# EAGLE design FPGA_Board (EAGLE 6.1)
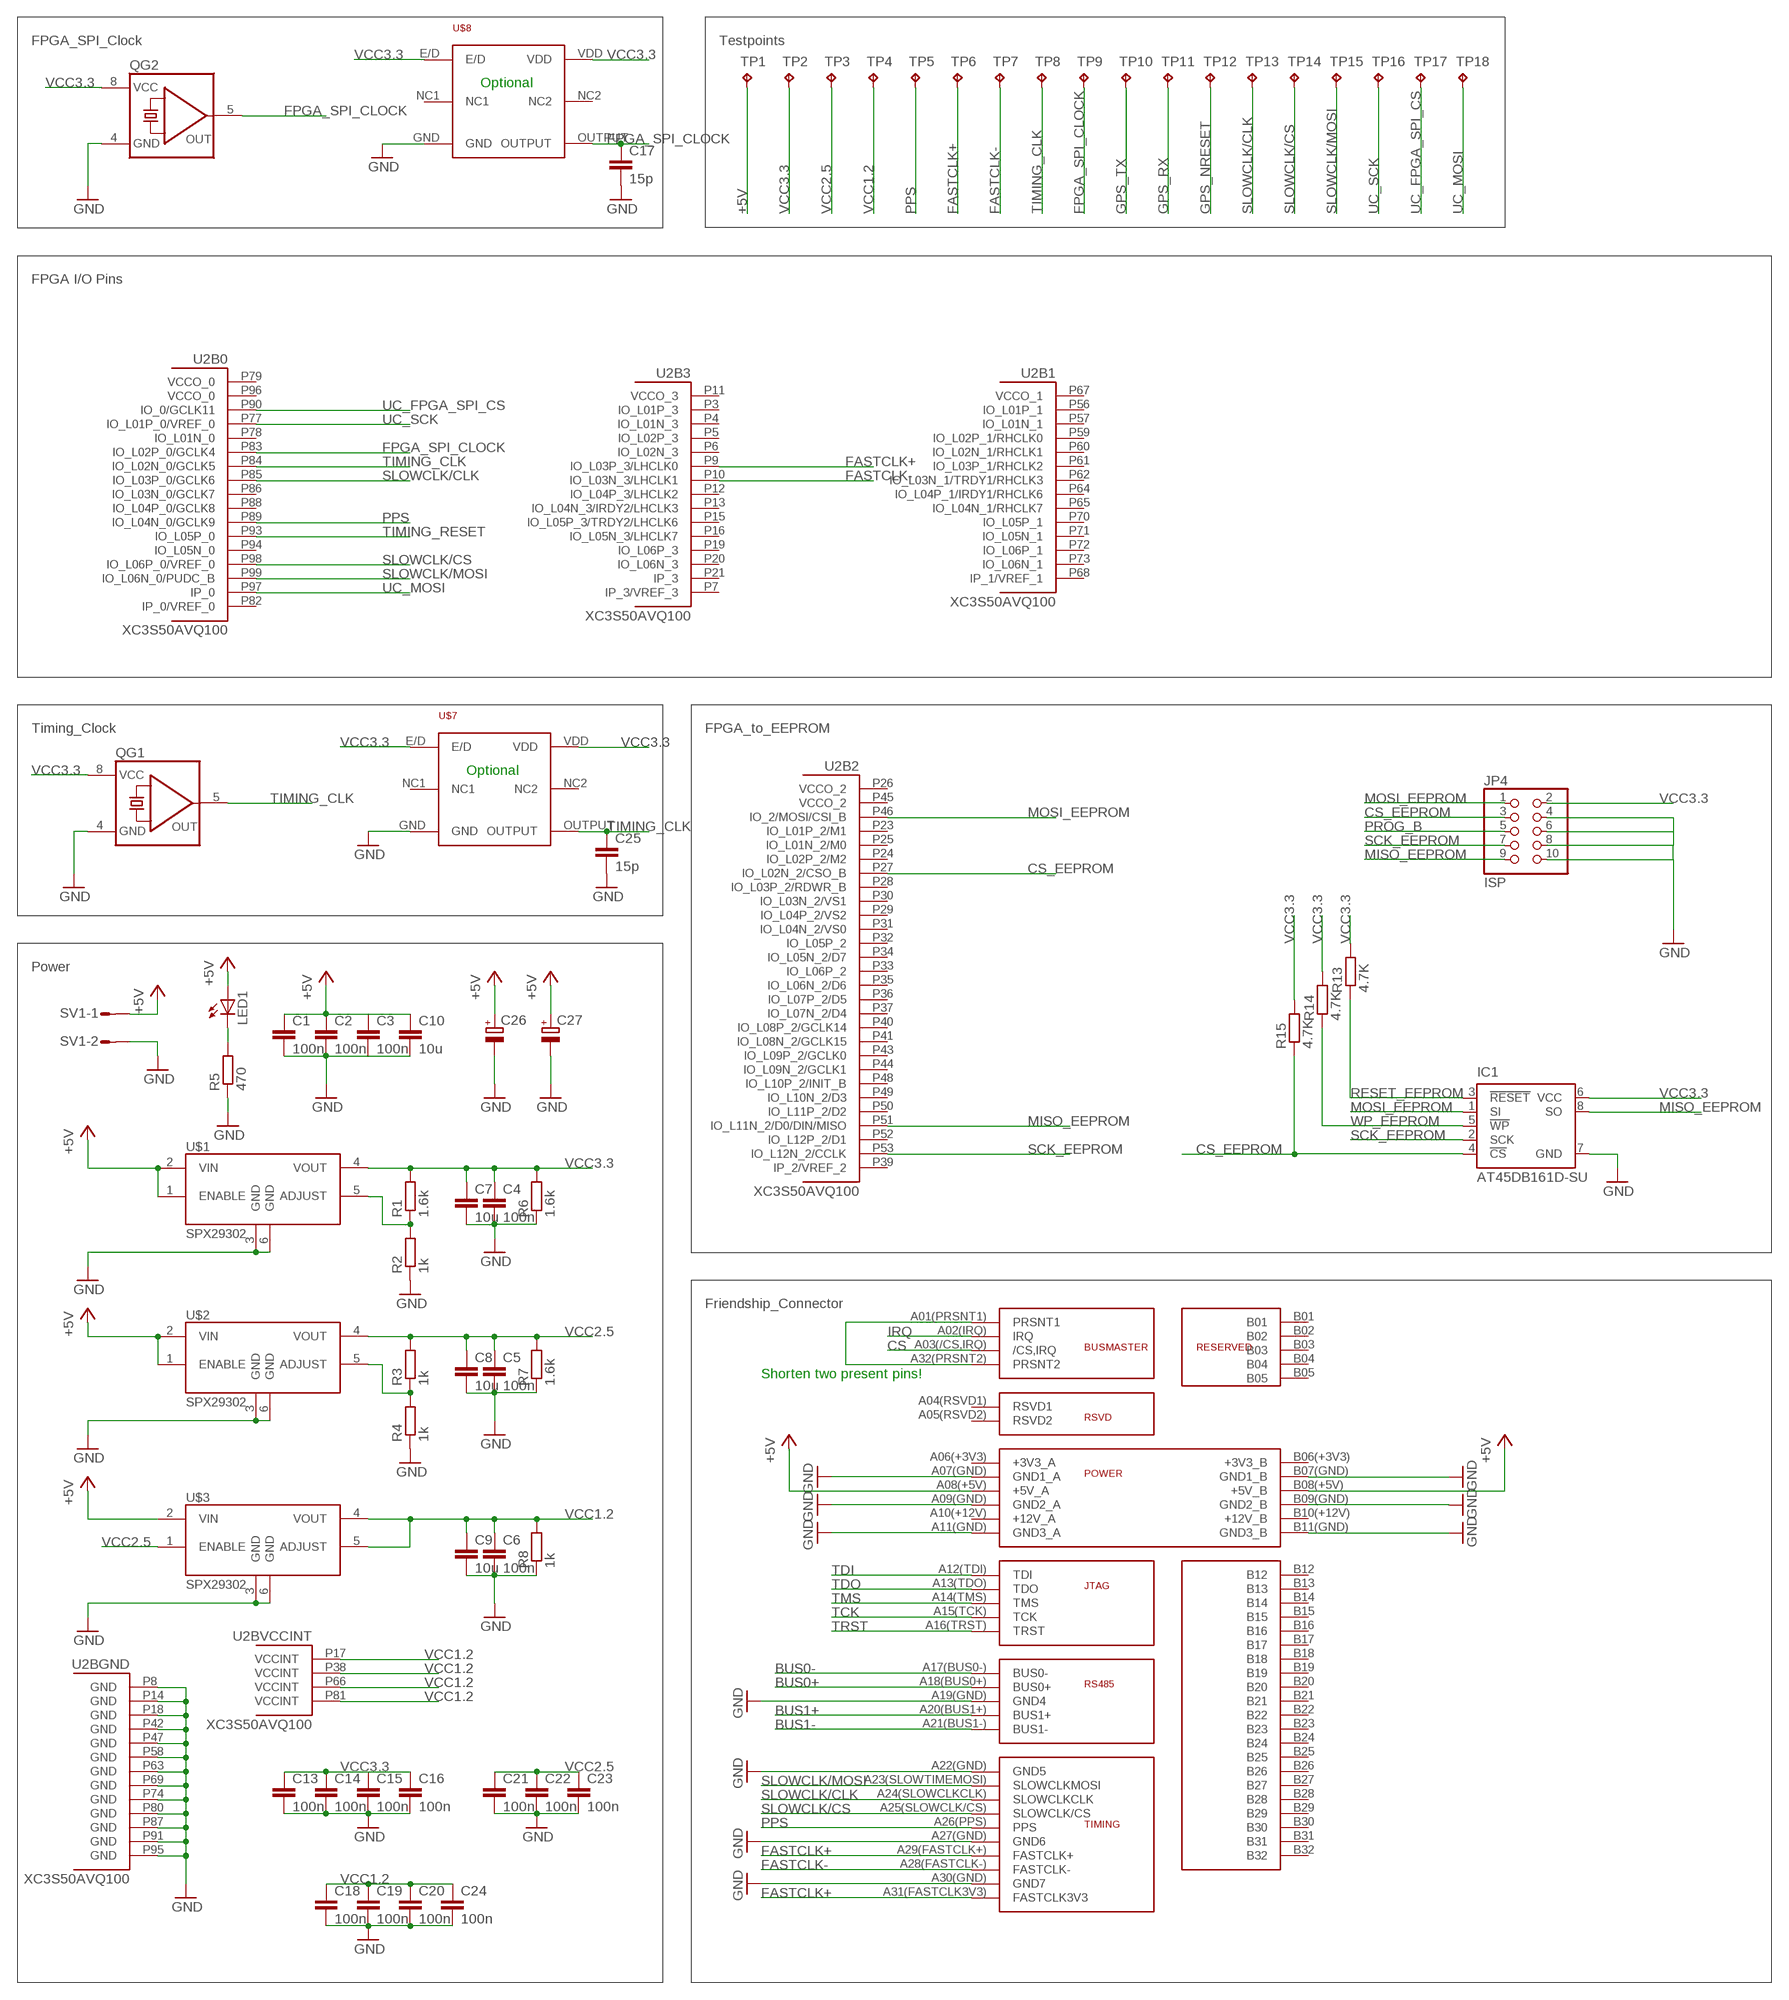
[diagram p0: schematic, sheet 1, part 1 of 2]
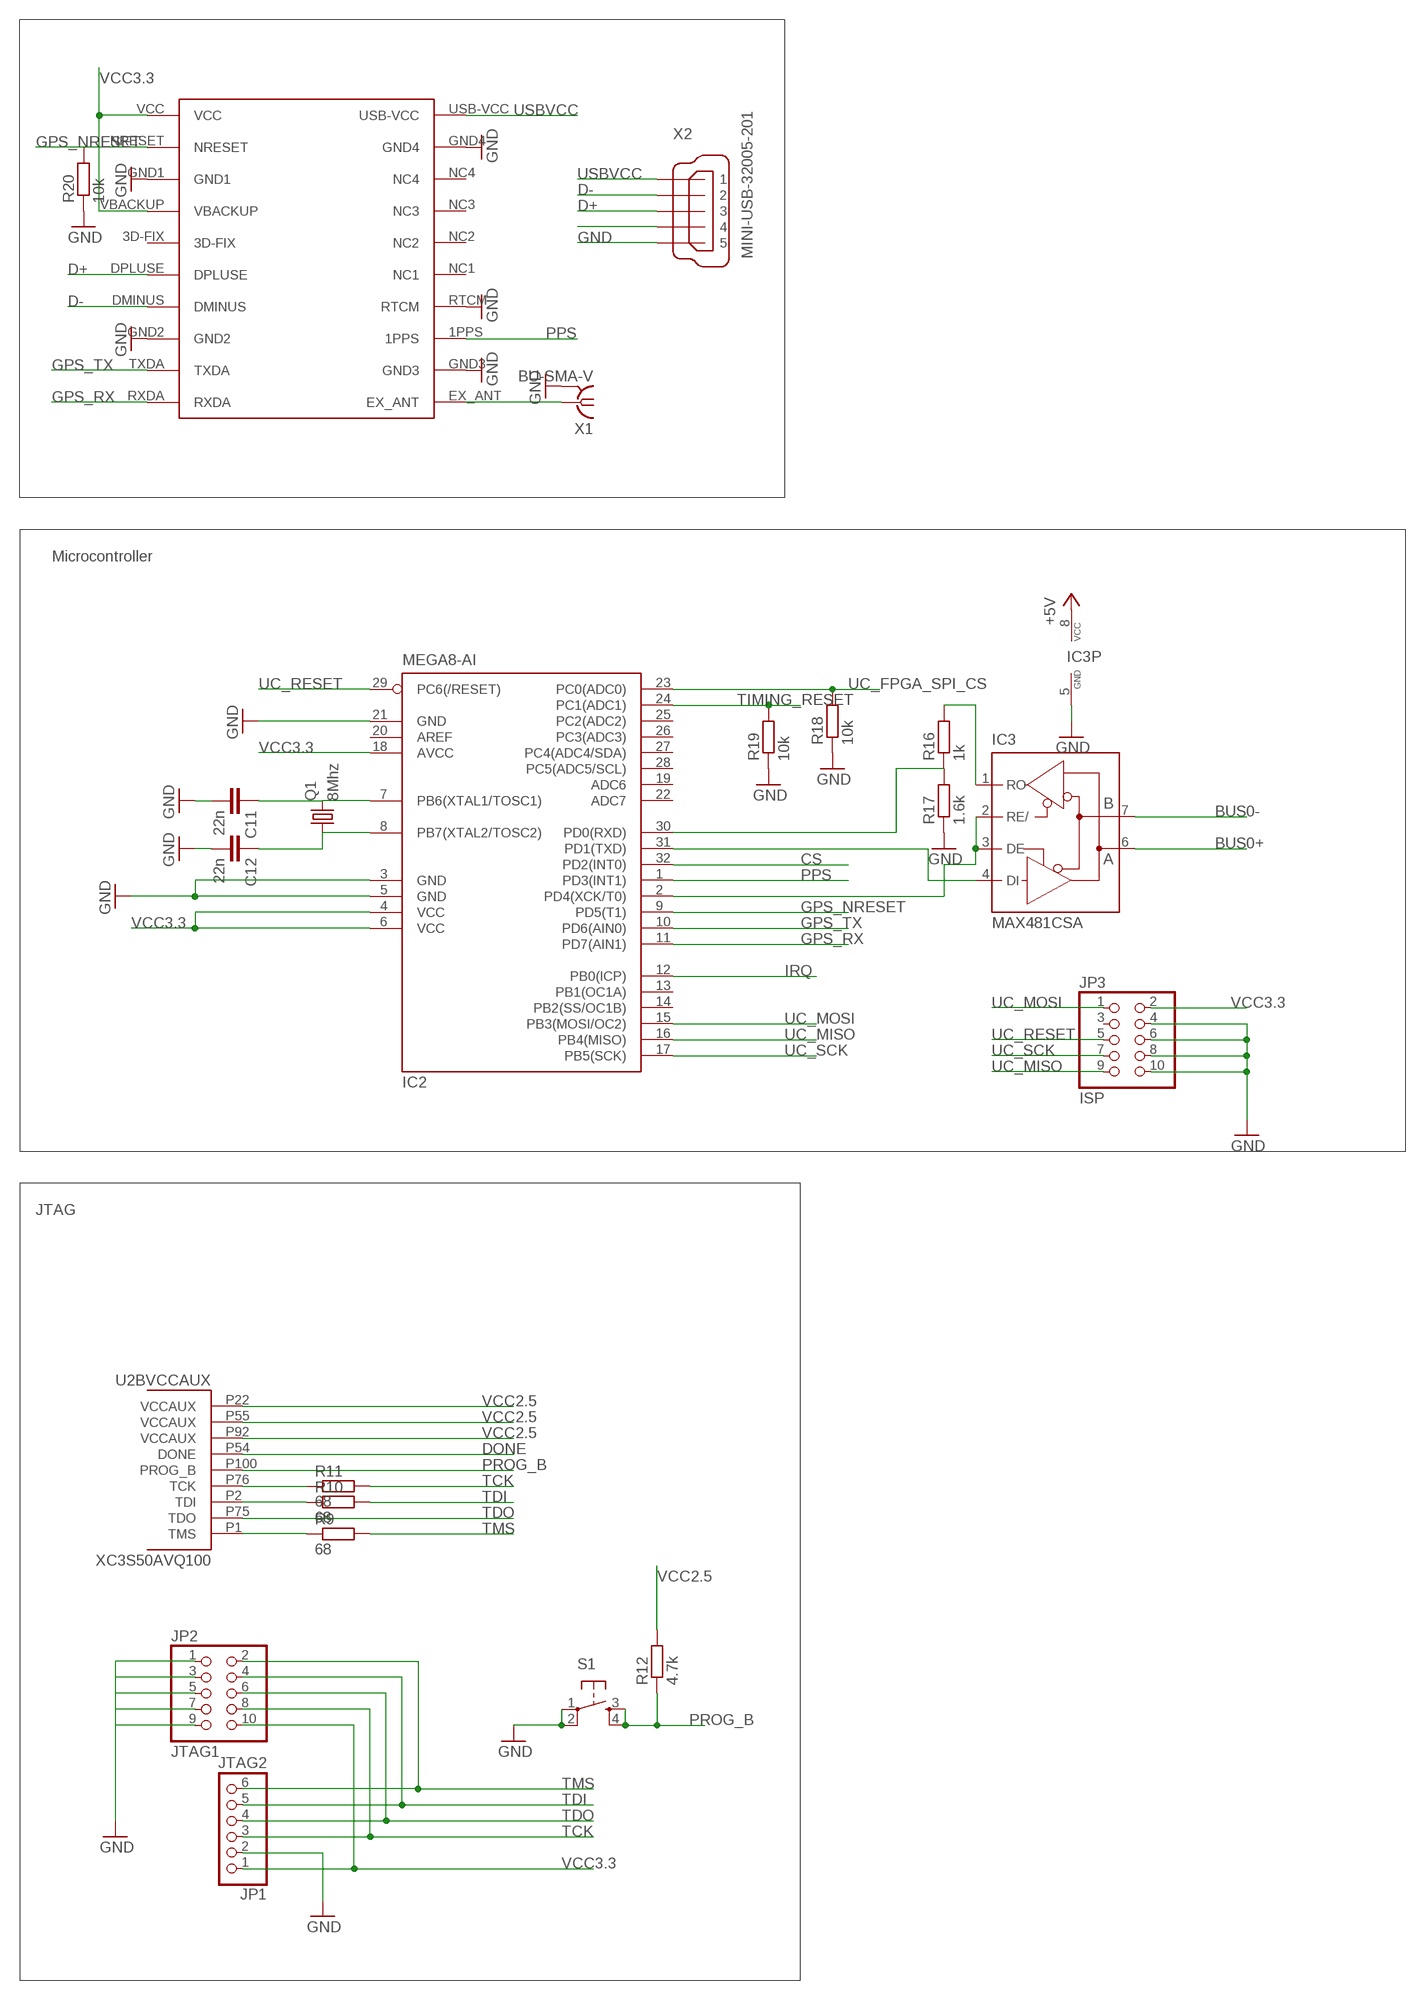
[diagram p1: schematic, sheet 1, part 2 of 2]

## Parts
C1  100n  C-EUC0603  [C0603]
C2  100n  C-EUC0603  [C0603]
C3  100n  C-EUC0603  [C0603]
C4  100n  C-EUC0603  [C0603]
C5  100n  C-EUC0603  [C0603]
C6  100n  C-EUC0603  [C0603]
C7  10u  C-EUC0603  [C0603]
C8  10u  C-EUC0603  [C0603]
C9  10u  C-EUC0603  [C0603]
C10  10u  C-EUC0603  [C0603]
C11  22n  C-EUC0603  [C0603]
C12  22n  C-EUC0603  [C0603]
C13  100n  C-EUC0603  [C0603]
C14  100n  C-EUC0603  [C0603]
C15  100n  C-EUC0603  [C0603]
C16  100n  C-EUC0603  [C0603]
C17  15p  C-EUC0603  [C0603]
C18  100n  C-EUC0603  [C0603]
C19  100n  C-EUC0603  [C0603]
C20  100n  C-EUC0603  [C0603]
C21  100n  C-EUC0603  [C0603]
C22  100n  C-EUC0603  [C0603]
C23  100n  C-EUC0603  [C0603]
C24  100n  C-EUC0603  [C0603]
C25  15p  C-EUC0603  [C0603]
C26  CPOL-EUE5-8.5  [E5-8,5]
C27  CPOL-EUE5-8.5  [E5-8,5]
IC1  AT45DB161D-SU  [8S2]
IC2  MEGA8-AI  [TQFP32-08]
IC3  MAX481CSA  [SO08]
JP1  JTAG2  PINHD-1X6  [1X06]
JP2  JTAG1  PINHD-2X5  [2X05]
JP3  ISP  PINHD-2X5  [2X05]
JP4  ISP  PINHD-2X5  [2X05]
LED1  LEDCHIPLED_0805  [CHIPLED_0805]
Q1  8Mhz  CRYSTALSM49  [SM49]
QG1  QG5460  [DIL08S]
QG2  QG5460  [DIL08S]
R1  1.6k  R-EU_R0603  [R0603]
R2  1k  R-EU_R0603  [R0603]
R3  1k  R-EU_R0603  [R0603]
R4  1k  R-EU_R0603  [R0603]
R5  470  R-EU_R0603  [R0603]
R6  1.6k  R-EU_R0603  [R0603]
R7  1.6k  R-EU_R0603  [R0603]
R8  1k  R-EU_R0603  [R0603]
R9  68  R-EU_R0603  [R0603]
R10  68  R-EU_R0603  [R0603]
R11  68  R-EU_R0603  [R0603]
R12  4.7k  R-EU_R0603  [R0603]
R13  4.7K  R-EU_R0603  [R0603]
R14  4.7K  R-EU_R0603  [R0603]
R15  4.7K  R-EU_R0603  [R0603]
R16  1k  R-EU_R0603  [R0603]
R17  1.6k  R-EU_R0603  [R0603]
R18  10k  R-EU_R0603  [R0603]
R19  10k  R-EU_R0603  [R0603]
R20  10k  R-EU_R0603  [R0603]
S1  TAC_SWITCHPTH  [TACTILE-PTH]
SV1  L02P  [L02P]
TP1  TPB2,54  [B2,54]
TP2  TPB2,54  [B2,54]
TP3  TPB2,54  [B2,54]
TP4  TPB2,54  [B2,54]
TP5  TPB2,54  [B2,54]
TP6  TPB2,54  [B2,54]
TP7  TPB2,54  [B2,54]
TP8  TPB2,54  [B2,54]
TP9  TPB2,54  [B2,54]
TP10  TPB2,54  [B2,54]
TP11  TPB2,54  [B2,54]
TP12  TPB2,54  [B2,54]
TP13  TPB2,54  [B2,54]
TP14  TPB2,54  [B2,54]
TP15  TPB2,54  [B2,54]
TP16  TPB2,54  [B2,54]
TP17  TPB2,54  [B2,54]
TP18  TPB2,54  [B2,54]
U2  XC3S50AVQ100  [VQ100]
U$1  SPX29302  [Q5-DD_SPX29300]
U$2  SPX29302  [Q5-DD_SPX29300]
U$3  SPX29302  [Q5-DD_SPX29300]
U$4  FRIENDSHIPCONNECTOR  [FRIENDSHIP_EDGE_CONNECTOR]
U$5  HGG_LOGO  [HGG_LOGO]
U$6  GPS  [GPS]
U$7  OSCILLATOR  [OSCILLATOR]
U$8  OSCILLATOR  [OSCILLATOR]
X1  BU-SMA-V  [BU-SMA-V]
X2  MINI-USB-32005-201  [32005-201]

## Nets
+5V: C1.1 C2.1 C3.1 C10.1 C26.+ C27.+ IC3.8(VCC) LED1.A SV1.1 TP1.TP U$1.1(ENABLE) U$1.2(VIN) U$2.1(ENABLE) U$2.2(VIN) U$3.2(VIN) U$4.A08(+5V)(+5V_A) U$4.B08(+5V)(+5V_B)
BUS0+: IC3.6(A) U$4.A18(BUS0+)(BUS0+)
BUS0-: IC3.7(B) U$4.A17(BUS0-)(BUS0-)
BUS1+: U$4.A20(BUS1+)(BUS1+)
BUS1-: U$4.A21(BUS1-)(BUS1-)
CS: IC2.32(PD2(INT0)) U$4.A03(/CS,IRQ)(/CS,IRQ)
CS_EEPROM: IC1.4(!CS) JP4.3 R15.1 U2.P27(B2:IO_L02N_2/CSO_B)
D+: U$6.DPLUSE X2.3
D-: U$6.DMINUS X2.2
DI: IC2.31(PD1(TXD)) IC3.4(DI)
DONE: U2.P54(BVCCAUX:DONE)
FASTCLK+: TP6.TP U2.P9(B3:IO_L03P_3/LHCLK0) U$4.A29(FASTCLK+)(FASTCLK+) U$4.A31(FASTCLK3V3)(FASTCLK3V3)
FASTCLK-: TP7.TP U2.P10(B3:IO_L03N_3/LHCLK1) U$4.A28(FASTCLK-)(FASTCLK-)
FPGA_SPI_CLOCK: C17.1 QG2.5(OUT) TP9.TP U2.P83(B0:IO_L02P_0/GCLK4) U$8.OUTPUT
GND: C1.2 C2.2 C3.2 C4.2 C5.2 C6.2 C7.2 C8.2 C9.2 C10.2 C11.2 C12.2 C13.2 C14.2 C15.2 C16.2 C17.2 C18.2 C19.2 C20.2 C21.2 C22.2 C23.2 C24.2 C25.2 C26.- C27.- IC1.7(GND) IC2.3(GND) IC2.5(GND) IC2.21(GND) IC3.5(GND) JP1.2 JP2.1 JP2.3 JP2.5 JP2.7 JP2.9 JP3.4 JP3.6 JP3.8 JP3.10 JP4.4 JP4.6 JP4.8 JP4.10 QG1.4(GND) QG2.4(GND) R2.1 R4.1 R5.1 R6.1 R7.1 R8.1 R17.1 R18.1 R19.1 R20.1 S1.1 S1.2 SV1.2 U2.P8(BGND:GND) U2.P14(BGND:GND) U2.P18(BGND:GND) U2.P42(BGND:GND) U2.P47(BGND:GND) U2.P58(BGND:GND) U2.P63(BGND:GND) U2.P69(BGND:GND) U2.P74(BGND:GND) U2.P80(BGND:GND) U2.P87(BGND:GND) U2.P91(BGND:GND) U2.P95(BGND:GND) U$1.3(GND) U$1.6(GND) U$2.3(GND) U$2.6(GND) U$3.3(GND) U$3.6(GND) U$4.A07(GND)(GND1_A) U$4.A09(GND)(GND2_A) U$4.A11(GND)(GND3_A) U$4.A19(GND)(GND4) U$4.A22(GND)(GND5) U$4.A27(GND)(GND6) U$4.A30(GND)(GND7) U$4.B07(GND)(GND1_B) U$4.B09(GND)(GND2_B) U$4.B11(GND)(GND3_B) U$6.GND1 U$6.GND2 U$6.GND3 U$6.GND4 U$6.RTCM U$7.GND U$8.GND X1.2(GND) X2.5
GPS_NRESET: IC2.9(PD5(T1)) R20.2 TP12.TP U$6.NRESET
GPS_RX: IC2.11(PD7(AIN1)) TP11.TP U$6.RXDA
GPS_TX: IC2.10(PD6(AIN0)) TP10.TP U$6.TXDA
IRQ: IC2.12(PB0(ICP)) U$4.A02(IRQ)(IRQ)
MISO_EEPROM: IC1.8(SO) JP4.9 U2.P51(B2:IO_L11N_2/D0/DIN/MISO)
MOSI_EEPROM: IC1.1(SI) JP4.1 U2.P46(B2:IO_2/MOSI/CSI_B)
N$1: R11.1 U2.P76(BVCCAUX:TCK)
N$2: R10.1 U2.P2(BVCCAUX:TDI)
N$3: LED1.C R5.2
N$4: R9.1 U2.P1(BVCCAUX:TMS)
N$5: IC2.2(PD4(XCK/T0)) IC3.2(RE/) IC3.3(DE)
N$6: IC2.30(PD0(RXD)) R16.1 R17.2
N$7: R1.1 R2.2 U$1.5(ADJUST)
N$8: R3.1 R4.2 U$2.5(ADJUST)
N$9: IC3.1(RO) R16.2
N$11: C11.1 IC2.7(PB6(XTAL1/TOSC1)) Q1.2
N$12: C12.1 IC2.8(PB7(XTAL2/TOSC2)) Q1.1
N$13: U$4.A01(PRSNT1)(PRSNT1) U$4.A32(PRSNT2)(PRSNT2)
N$14: U$6.EX_ANT X1.1
N$15: X2.4
PPS: IC2.1(PD3(INT1)) TP5.TP U2.P89(B0:IO_L04N_0/GCLK9) U$4.A26(PPS)(PPS) U$6.1PPS
PROG_B: JP4.5 R12.1 S1.3 S1.4 U2.P100(BVCCAUX:PROG_B)
RESET_EEPROM: IC1.3(!RESET) R13.1
SCK_EEPROM: IC1.2(SCK) JP4.7 U2.P53(B2:IO_L12N_2/CCLK)
SLOWCLK/CLK: TP13.TP U2.P85(B0:IO_L03P_0/GCLK6) U$4.A24(SLOWCLKCLK)(SLOWCLKCLK)
SLOWCLK/CS: TP14.TP U2.P98(B0:IO_L06P_0/VREF_0) U$4.A25(SLOWCLK/CS)(SLOWCLK/CS)
SLOWCLK/MOSI: TP15.TP U2.P99(B0:IO_L06N_0/PUDC_B) U$4.A23(SLOWTIMEMOSI)(SLOWCLKMOSI)
TCK: JP1.3 JP2.8 R11.2 U$4.A15(TCK)(TCK)
TDI: JP1.5 JP2.4 R10.2 U$4.A12(TDI)(TDI)
TDO: JP1.4 JP2.6 U2.P75(BVCCAUX:TDO) U$4.A13(TDO)(TDO)
TIMING_CLK: C25.1 QG1.5(OUT) TP8.TP U2.P84(B0:IO_L02N_0/GCLK5) U$7.OUTPUT
TIMING_RESET: IC2.24(PC1(ADC1)) R19.2 U2.P93(B0:IO_L05P_0)
TMS: JP1.6 JP2.2 R9.2 U$4.A14(TMS)(TMS)
TRST: U$4.A16(TRST)(TRST)
UC_FPGA_SPI_CS: IC2.23(PC0(ADC0)) R18.2 TP17.TP U2.P90(B0:IO_0/GCLK11)
UC_MISO: IC2.16(PB4(MISO)) JP3.9
UC_MOSI: IC2.15(PB3(MOSI/OC2)) JP3.1 TP18.TP U2.P97(B0:IP_0)
UC_RESET: IC2.29(PC6(/RESET)) JP3.5
UC_SCK: IC2.17(PB5(SCK)) JP3.7 TP16.TP U2.P77(B0:IO_L01P_0/VREF_0)
USBVCC: U$6.USB-VCC X2.1
VCC1.2: C6.1 C9.1 C18.1 C19.1 C20.1 C24.1 R8.2 TP4.TP U2.P17(BVCCINT:VCCINT) U2.P38(BVCCINT:VCCINT) U2.P66(BVCCINT:VCCINT) U2.P81(BVCCINT:VCCINT) U$3.4(VOUT) U$3.5(ADJUST)
VCC2.5: C5.1 C8.1 C21.1 C22.1 C23.1 R3.2 R7.2 R12.2 TP3.TP U2.P22(BVCCAUX:VCCAUX) U2.P55(BVCCAUX:VCCAUX) U2.P92(BVCCAUX:VCCAUX) U$2.4(VOUT) U$3.1(ENABLE)
VCC3.3: C4.1 C7.1 C13.1 C14.1 C15.1 C16.1 IC1.6(VCC) IC2.4(VCC) IC2.6(VCC) IC2.18(AVCC) JP1.1 JP2.10 JP3.2 JP4.2 QG1.8(VCC) QG2.8(VCC) R1.2 R6.2 R13.2 R14.2 R15.2 TP2.TP U$1.4(VOUT) U$6.VBACKUP U$6.VCC U$7.E/D U$7.VDD U$8.E/D U$8.VDD
WP_EEPROM: IC1.5(!WP) R14.1
Unconnected: IC2.13(PB1(OC1A)) IC2.14(PB2(SS/OC1B)) IC2.19(ADC6) IC2.20(AREF) IC2.22(ADC7) IC2.25(PC2(ADC2)) IC2.26(PC3(ADC3)) IC2.27(PC4(ADC4/SDA)) IC2.28(PC5(ADC5/SCL)) JP3.3 U2.P3(B3:IO_L01P_3) U2.P4(B3:IO_L01N_3) U2.P5(B3:IO_L02P_3) U2.P6(B3:IO_L02N_3) U2.P7(B3:IP_3/VREF_3) U2.P11(B3:VCCO_3) U2.P12(B3:IO_L04P_3/LHCLK2) U2.P13(B3:IO_L04N_3/IRDY2/LHCLK3) U2.P15(B3:IO_L05P_3/TRDY2/LHCLK6) U2.P16(B3:IO_L05N_3/LHCLK7) U2.P19(B3:IO_L06P_3) U2.P20(B3:IO_L06N_3) U2.P21(B3:IP_3) U2.P23(B2:IO_L01P_2/M1) U2.P24(B2:IO_L02P_2/M2) U2.P25(B2:IO_L01N_2/M0) U2.P26(B2:VCCO_2) U2.P28(B2:IO_L03P_2/RDWR_B) U2.P29(B2:IO_L04P_2/VS2) U2.P30(B2:IO_L03N_2/VS1) U2.P31(B2:IO_L04N_2/VS0) U2.P32(B2:IO_L05P_2) U2.P33(B2:IO_L06P_2) U2.P34(B2:IO_L05N_2/D7) U2.P35(B2:IO_L06N_2/D6) U2.P36(B2:IO_L07P_2/D5) U2.P37(B2:IO_L07N_2/D4) U2.P39(B2:IP_2/VREF_2) U2.P40(B2:IO_L08P_2/GCLK14) U2.P41(B2:IO_L08N_2/GCLK15) U2.P43(B2:IO_L09P_2/GCLK0) U2.P44(B2:IO_L09N_2/GCLK1) U2.P45(B2:VCCO_2) U2.P48(B2:IO_L10P_2/INIT_B) U2.P49(B2:IO_L10N_2/D3) U2.P50(B2:IO_L11P_2/D2) U2.P52(B2:IO_L12P_2/D1) U2.P56(B1:IO_L01P_1) U2.P57(B1:IO_L01N_1) U2.P59(B1:IO_L02P_1/RHCLK0) U2.P60(B1:IO_L02N_1/RHCLK1) U2.P61(B1:IO_L03P_1/RHCLK2) U2.P62(B1:IO_L03N_1/TRDY1/RHCLK3) U2.P64(B1:IO_L04P_1/IRDY1/RHCLK6) U2.P65(B1:IO_L04N_1/RHCLK7) U2.P67(B1:VCCO_1) U2.P68(B1:IP_1/VREF_1) U2.P70(B1:IO_L05P_1) U2.P71(B1:IO_L05N_1) U2.P72(B1:IO_L06P_1) U2.P73(B1:IO_L06N_1) U2.P78(B0:IO_L01N_0) U2.P79(B0:VCCO_0) U2.P82(B0:IP_0/VREF_0) U2.P86(B0:IO_L03N_0/GCLK7) U2.P88(B0:IO_L04P_0/GCLK8) U2.P94(B0:IO_L05N_0) U2.P96(B0:VCCO_0) U$4.A04(RSVD1)(RSVD1) U$4.A05(RSVD2)(RSVD2) U$4.A06(+3V3)(+3V3_A) U$4.A10(+12V)(+12V_A) U$4.B01 U$4.B02 U$4.B03 U$4.B04 U$4.B05 U$4.B06(+3V3)(+3V3_B) U$4.B10(+12V)(+12V_B) U$4.B12 U$4.B13 U$4.B14 U$4.B15 U$4.B16 U$4.B17 U$4.B18 U$4.B19 U$4.B20 U$4.B21 U$4.B22 U$4.B23 U$4.B24 U$4.B25 U$4.B26 U$4.B27 U$4.B28 U$4.B29 U$4.B30 U$4.B31 U$4.B32 U$6.3D-FIX U$6.NC1 U$6.NC2 U$6.NC3 U$6.NC4 U$7.NC1 U$7.NC2 U$8.NC1 U$8.NC2

## Notes on the sheet
- FPGA_SPI_Clock | Testpoints
- Optional
- FPGA I/O Pins
- Timing_Clock | FPGA_to_EEPROM | Microcontroller
- Optional
- Power
- Friendship_Connector | JTAG
- Shorten two present pins!

## Power pins joined to a net without a drawn wire
GND: X1.3(GND) X1.4(GND) X1.5(GND)

## Library data of the parts
C1-C25 = resistor:C-EU: CAPACITOR, European symbol
C26 C27 = resistor:CPOL-EU: POLARIZED CAPACITOR, European symbol
IC1 = atmel:AT45DB161D: 16-megabit 2.5V or 2.7V DataFlash Source: http://www.atmel.com/dyn/resources/prod_documents/doc3500.pdf; MF: ATMEL; MPN: AT45DB161D-SU; OC_FARNELL: 1455040
IC2 = atmel:MEGA8: MICROCONTROLLER 8 Kbytes FLASH, 1 kbytes SRAM, 512 bytes EEPROM, USART, 6-channel 10 bit ADC, 2-channel 8 bit ADC Pin compatible with Atmega48, ATMega88, ATMega168 Source: avr.lbr; MPN: ATMEGA8-16AU; OC_FARNELL: 9171371; OC_NEWARK: 73M8863
IC3 = maxim:MAX481CSA: RS485 TRANSEIVER; MF: MAXIM; MPN: MAX481CSA; OC_FARNELL: unknown; OC_NEWARK: 90C3817
JP1 = pinhead:PINHD-1X6: PIN HEADER
JP2-JP4 = pinhead:PINHD-2X5: PIN HEADER
LED1 = led:LED: LED OSRAM: - CHIPLED LG R971, LG N971, LY N971, LG Q971, LY Q971, LO R971, LY R971 LH N974, LH R974 LS Q976, LO Q976, LY Q976 LO Q996 - Hyper CHIPLED LW Q18S LB Q993, LB Q99A, LB R99A - SideLED LS A670, LO A670, LY A670, LG A670, LP A670 LB A673, LV A673, LT A673, LW A673 LH A674 LY A675 LS A676, LA A676, LO A676, LY A676, LW A676 LS A679, LY A679, LG A679 - Hyper Micro SIDELED® LS Y876, LA Y876, LO Y876, LY Y876 LT Y87S - SmartLED LW L88C, LW L88S LB L89C, LB L89S, LG L890 LS L89K, LO L89K, LY L89K LS L896, LA L896, LO L896, LY L896 - TOPLED LS T670, LO T670, LY T670, LG T670, LP T670 LSG T670, LSP T670, LSY T670, LOP T670, LYG T670 LG T671, LOG T671, LSG T671 LB T673, LV T673, LT T673, LW T673 LH T674 LS T676, LA T676, LO T676, LY T676, LB T676, LH T676, LSB T676, LW T676 LB T67C, LV T67C, LT T67C, LS T67K, LO T67K, LY T67K, LW E67C LS E67B, LA E67B, LO E67B, LY E67B, LB E67C, LV E67C, LT E67C LW T67C LS T679, LY T679, LG T679 LS T770, LO T770, LY T770, LG T770, LP T770 LB T773, LV T773, LT T773, LW T773 LH T774 LS E675, LA E675, LY E675, LS T675 LS T776, LA T776, LO T776, LY T776, LB T776 LHGB T686 LT T68C, LB T68C - Hyper Mini TOPLED® LB M676 - Mini TOPLED Santana® LG M470 LS M47K, LO M47K, LY M47K Source: http://www.osram.convergy.de LUXEON: - LUMILED® LXK2-PW12-R00, LXK2-PW12-S00, LXK2-PW14-U00, LXK2-PW14-V00 LXK2-PM12-R00, LXK2-PM12-S00, LXK2-PM14-U00 LXK2-PE12-Q00, LXK2-PE12-R00, LXK2-PE12-S00, LXK2-PE14-T00, LXK2-PE14-U00 LXK2-PB12-K00, LXK2-PB12-L00, LXK2-PB12-M00, LXK2-PB14-N00, LXK2-PB14-P00, LXK2-PB14-Q00 LXK2-PR12-L00, LXK2-PR12-M00, LXK2-PR14-Q00, LXK2-PR14-R00 LXK2-PD12-Q00, LXK2-PD12-R00, LXK2-PD12-S00 LXK2-PH12-R00, LXK2-PH12-S00 LXK2-PL12-P00, LXK2-PL12-Q00, LXK2-PL12-R00 Source: www.luxeon.com KINGBRIGHT: KA-3528ASYC Source: www.kingbright.com
Q1 = crystal:CRYSTAL: CRYSTAL; OC_FARNELL: unknown; OC_NEWARK: unknown
QG1 QG2 = crystal:QG5460: CRYSTAL RESONATOR; OC_FARNELL: unknown; OC_NEWARK: unknown
R1-R20 = resistor:R-EU_: RESISTOR, European symbol
S1 = SparkFun:TAC_SWITCH: Momentary Switch Button commonly used for reset or general input. Spark Fun Electronics SKU : COM-00097
SV1 = con-amp-mt:L02P: AMP MT CONNECTOR; OC_FARNELL: unknown; OC_NEWARK: unknown
TP1-TP18 = testpad:TP: Test pad
U2 = xilinx_devices:XC3S50AVQ100: Xilinx FPGA: XC3S50AVQ100
U$1-U$3 = SparkFun:SPX29302
U$4 = hgg:FRIENDSHIP
U$5 = hgg:HGG_LOGO
U$6 = hgg:GPS
U$7 U$8 = hgg:OSCILLATOR
X1 = con-coax:BU-SMA-V: FEMALE SMA CONNECTOR Radiall distributor RS 112-3794; OC_FARNELL: unknown; OC_NEWARK: unknown
X2 = con-cypressindustries:MINI-USB-: MINI USB-B Conector Source: www.cypressindustries.com; OC_FARNELL: unknown; OC_NEWARK: unknown

## Board
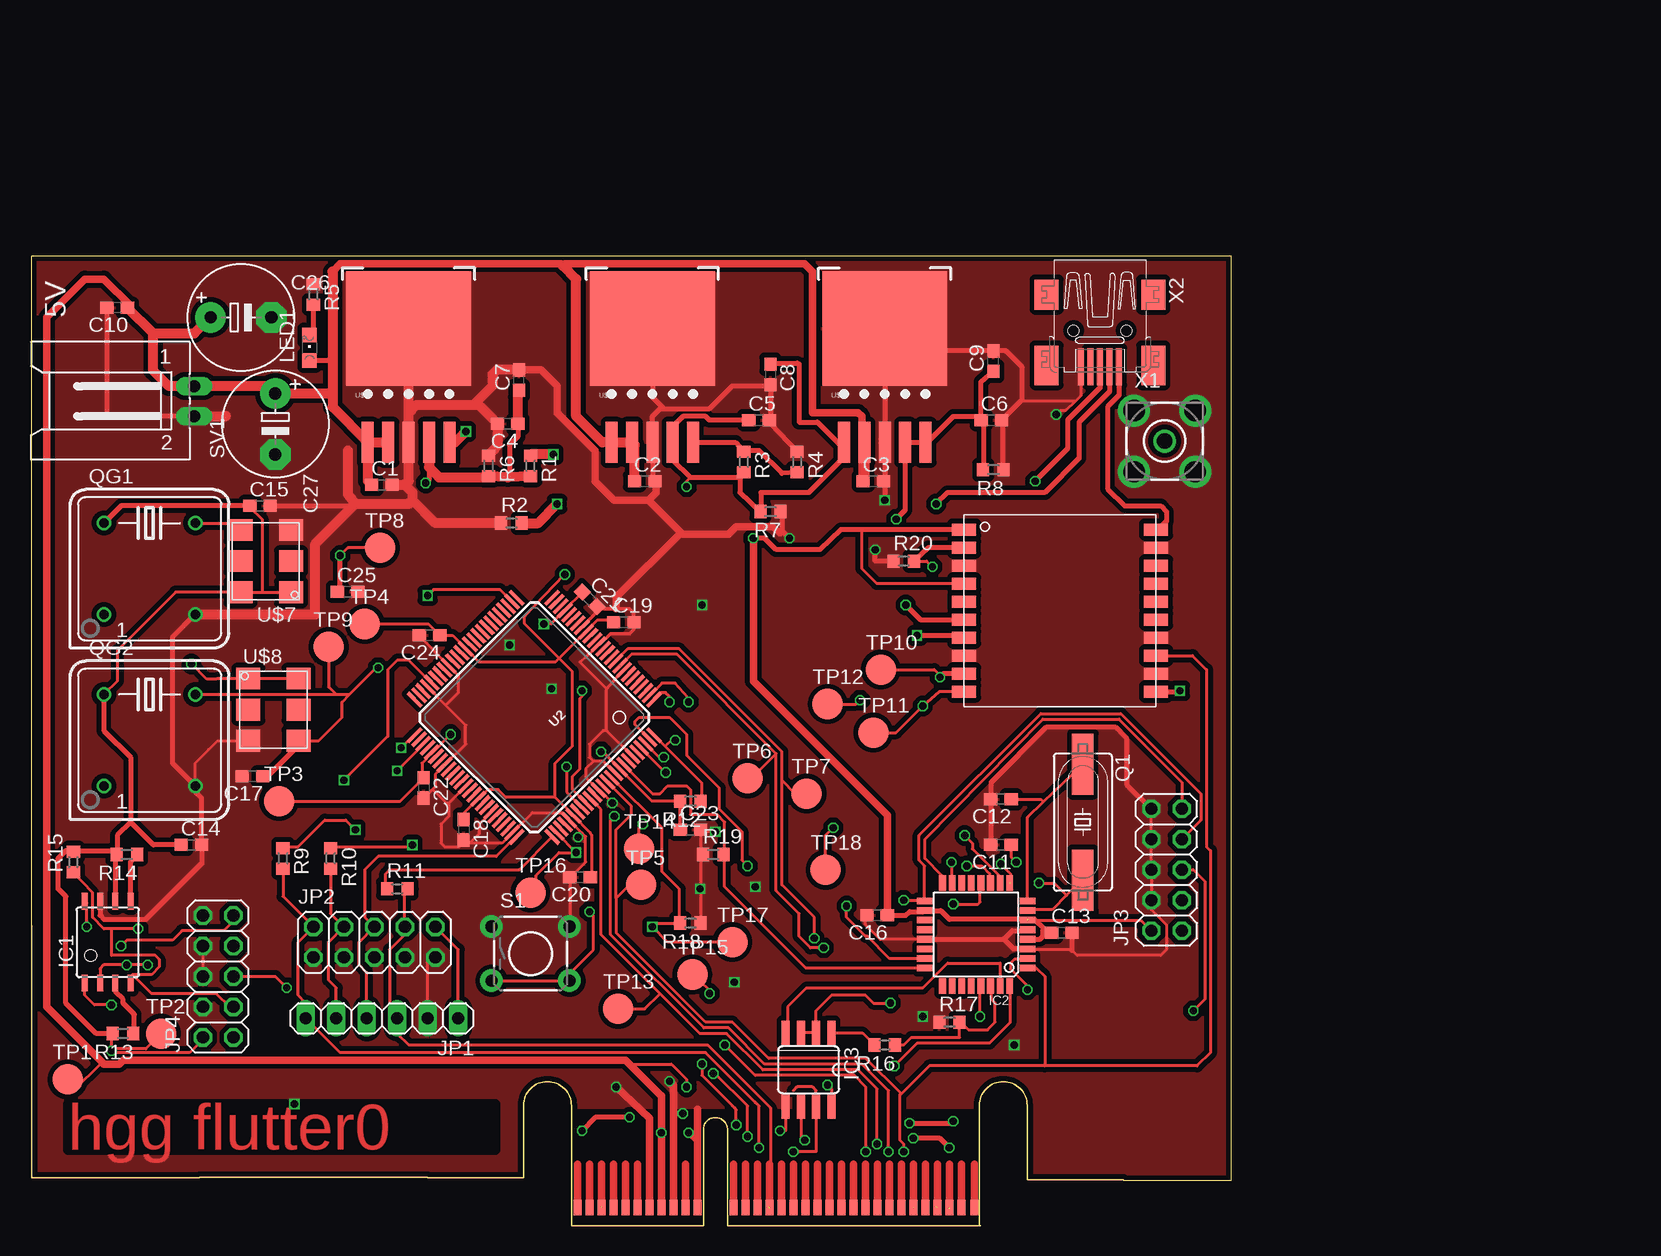
[diagram p2: board, top side]
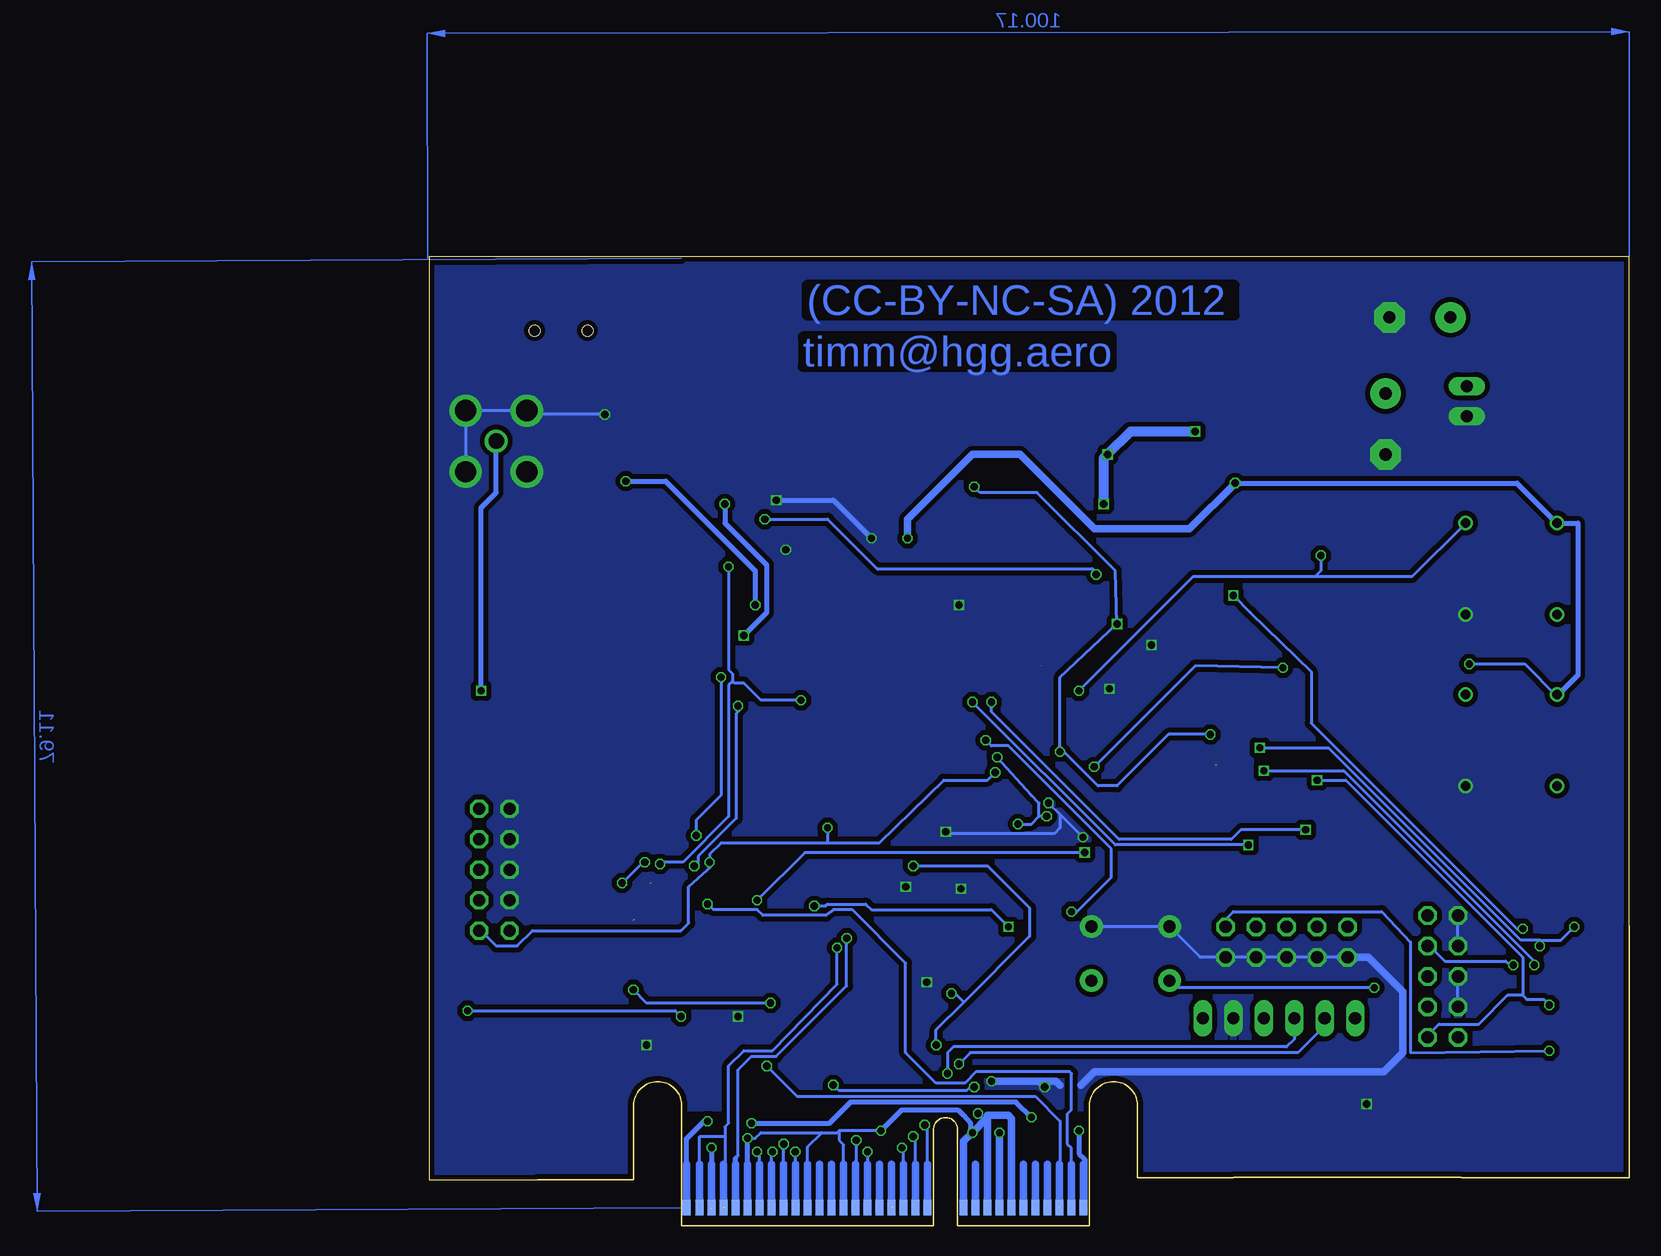
[diagram p3: board, bottom side, seen from below]

Size 100 x 80.77 mm. Coordinates in mm from the lower left corner, seen from the top.
Outline: 0,80.76 100,80.76 100,3.76 91,3.76
Outline: 0,24.89 0,80.77
Copper layers (1*16): Top 0.035mm / dielectric 1.5mm / Bottom 0.035mm
Design rules: minimum track width 0.125mm, minimum drill 0.2mm, track to track 0.125mm, track to pad 0.125mm, pad to pad 0.125mm, via to via 0.125mm, smd to smd 0.125mm, copper to edge 0.3mm, drill to drill 0.2mm, minimum pad ring 0.2mm, minimum via ring 0.125mm, stop-mask expansion 0.075mm, vias tented up to drill 0mil, thermal gap 0mil

### Footprints (pad centres in the part's own frame; a part is rotated, then mirrored left to right if it is on the bottom)
C0603 = smd 1.1 x 1: 1 -0.85,0; 2 0.85,0
E5-8,5 = drill 1.016 pad 2.54: + -2.54,0 | drill 1.016 pad 2.54 octagon: - 2.54,0
8S2 = smd 0.5 x 1.4: 1 -1.905,-3.404; 2 -0.645,-3.404; 3 0.625,-3.404; 4 1.895,-3.404; 5 1.905,3.404; 6 0.635,3.404; 7 -0.635,3.404; 8 -1.905,3.404
TQFP32-08 = smd 1.27 x 0.559: 1 -4.293,2.8; 2 -4.293,2; 3 -4.293,1.2; 4 -4.293,0.4; 5 -4.293,-0.4; 6 -4.293,-1.2; 7 -4.293,-2; 8 -4.293,-2.8; 17 4.293,-2.8; 18 4.293,-2; 19 4.293,-1.2; 20 4.293,-0.4; 21 4.293,0.4; 22 4.293,1.2; 23 4.293,2; 24 4.293,2.8 | smd 0.559 x 1.27: 9 -2.8,-4.293; 10 -2,-4.293; 11 -1.2,-4.293; 12 -0.4,-4.293; 13 0.4,-4.293; 14 1.2,-4.293; 15 2,-4.293; 16 2.8,-4.293; 25 2.8,4.293; 26 2,4.293; 27 1.2,4.293; 28 0.4,4.293; 29 -0.4,4.293; 30 -1.2,4.293; 31 -2,4.293; 32 -2.8,4.293
SO08 = smd 0.66 x 2.032: 1 -1.905,-3.073; 2 -0.635,-3.073; 3 0.635,-3.073; 4 1.905,-3.073; 5 1.905,3.073; 6 0.635,3.073; 7 -0.635,3.073; 8 -1.905,3.073
1X06 = drill 1.016 long: 1 -6.35,0; 2 -3.81,0; 3 -1.27,0; 4 1.27,0; 5 3.81,0; 6 6.35,0
2X05 = drill 1.016 octagon: 1 -5.08,-1.27; 2 -5.08,1.27; 3 -2.54,-1.27; 4 -2.54,1.27; 5 0,-1.27; 6 0,1.27; 7 2.54,-1.27; 8 2.54,1.27; 9 5.08,-1.27; 10 5.08,1.27
CHIPLED_0805 = smd 1.2 x 1.2: A 0,-1.05; C 0,1.05
SM49 = smd 5.08 x 1.778: 1 -4.826,0; 2 4.826,0
DIL08S = drill 0.813: 1 -3.81,-3.81; 4 3.81,-3.81; 5 3.81,3.81; 8 -3.81,3.81
R0603 = smd 1 x 1.1: 1 -0.85,0; 2 0.85,0
TACTILE-PTH = drill 1.016 pad 1.88: 1 -3.251,2.261; 2 3.251,2.261; 3 -3.251,-2.261; 4 3.251,-2.261
L02P = drill 1.016 long: 1 1.25,-6.25; 2 -1.25,-6.25
B2,54 = smd 2.54 x 2.54: TP 0,0
VQ100 = smd 1.6 x 0.3: P1 -8.1,6; P2 -8.1,5.5; P3 -8.1,5; P4 -8.1,4.5; P5 -8.1,4; P6 -8.1,3.5; P7 -8.1,3; P8 -8.1,2.5; P9 -8.1,2; P10 -8.1,1.5; P11 -8.1,1; P12 -8.1,0.5; P13 -8.1,0; P14 -8.1,-0.5; P15 -8.1,-1; P16 -8.1,-1.5; P17 -8.1,-2; P18 -8.1,-2.5; P19 -8.1,-3; P20 -8.1,-3.5; P21 -8.1,-4; P22 -8.1,-4.5; P23 -8.1,-5; P24 -8.1,-5.5; P25 -8.1,-6; P51 8.1,-6; P52 8.1,-5.5; P53 8.1,-5; P54 8.1,-4.5; P55 8.1,-4; P56 8.1,-3.5; P57 8.1,-3; P58 8.1,-2.5; P59 8.1,-2; P60 8.1,-1.5; P61 8.1,-1; P62 8.1,-0.5; P63 8.1,0; P64 8.1,0.5; P65 8.1,1; P66 8.1,1.5; P67 8.1,2; P68 8.1,2.5; P69 8.1,3; P70 8.1,3.5; P71 8.1,4; P72 8.1,4.5; P73 8.1,5; P74 8.1,5.5; P75 8.1,6 | smd 0.3 x 1.6: P26 -6,-8.1; P27 -5.5,-8.1; P28 -5,-8.1; P29 -4.5,-8.1; P30 -4,-8.1; P31 -3.5,-8.1; P32 -3,-8.1; P33 -2.5,-8.1; P34 -2,-8.1; P35 -1.5,-8.1; P36 -1,-8.1; P37 -0.5,-8.1; P38 0,-8.1; P39 0.5,-8.1; P40 1,-8.1; P41 1.5,-8.1; P42 2,-8.1; P43 2.5,-8.1; P44 3,-8.1; P45 3.5,-8.1; P46 4,-8.1; P47 4.5,-8.1; P48 5,-8.1; P49 5.5,-8.1; P50 6,-8.1; P76 6,8.1; P77 5.5,8.1; P78 5,8.1; P79 4.5,8.1; P80 4,8.1; P81 3.5,8.1; P82 3,8.1; P83 2.5,8.1; P84 2,8.1; P85 1.5,8.1; P86 1,8.1; P87 0.5,8.1; P88 0,8.1; P89 -0.5,8.1; P90 -1,8.1; P91 -1.5,8.1; P92 -2,8.1; P93 -2.5,8.1; P94 -3,8.1; P95 -3.5,8.1; P96 -4,8.1; P97 -4.5,8.1; P98 -5,8.1; P99 -5.5,8.1; P100 -6,8.1
Q5-DD_SPX29300 = smd 1 x 3.4: 1 -3.4,-7.875; 2 -1.7,-7.875; 3 0,-7.875; 4 1.7,-7.875; 5 3.4,-7.875 | smd 10.414 x 9.525: 6 0,1.595
FRIENDSHIP_EDGE_CONNECTOR = smd 0.66 x 1.27 bottom: A01(PRSNT1) 45.5,-14.5; A02(IRQ) 46.5,-14.5; A03(/CS,IRQ) 47.5,-14.5; A04(RSVD1) 48.5,-14.5; A05(RSVD2) 49.5,-14.5; A06(+3V3) 50.5,-14.5; A07(GND) 51.5,-14.5; A08(+5V) 52.5,-14.5; A09(GND) 53.5,-14.5; A10(+12V) 54.5,-14.5; A11(GND) 55.5,-14.5; A12(TDI) 58.5,-14.5; A13(TDO) 59.5,-14.5; A14(TMS) 60.5,-14.5; A15(TCK) 61.5,-14.5; A16(TRST) 62.5,-14.5; A17(BUS0-) 63.5,-14.5; A18(BUS0+) 64.5,-14.5; A19(GND) 65.5,-14.5; A20(BUS1+) 66.5,-14.5; A21(BUS1-) 67.5,-14.5; A22(GND) 68.5,-14.5; A23(SLOWTIMEMOSI) 69.5,-14.5; A24(SLOWCLKCLK) 70.5,-14.5; A25(SLOWCLK/CS) 71.5,-14.5; A26(PPS) 72.5,-14.5; A27(GND) 73.5,-14.5; A28(FASTCLK-) 74.5,-14.5; A29(FASTCLK+) 75.5,-14.5; A30(GND) 76.5,-14.5; A31(FASTCLK3V3) 77.5,-14.5; A32(PRSNT2) 78.6,-14.5 | smd 0.66 x 1.27: B01 45.5,-14.5; B02 46.5,-14.5; B03 47.5,-14.5; B04 48.5,-14.5; B05 49.5,-14.5; B06(+3V3) 50.5,-14.5; B07(GND) 51.5,-14.5; B08(+5V) 52.5,-14.5; B09(GND) 53.5,-14.5; B10(+12V) 54.5,-14.5; B11(GND) 55.5,-14.5; B12 58.5,-14.5; B13 59.5,-14.5; B14 60.5,-14.5; B15 61.5,-14.5; B16 62.5,-14.5; B17 63.5,-14.5; B18 64.5,-14.5; B19 65.5,-14.5; B20 66.5,-14.5; B21 67.5,-14.5; B22 68.5,-14.5; B23 69.5,-14.5; B24 70.5,-14.5; B25 71.5,-14.5; B26 72.5,-14.5; B27 73.5,-14.5; B28 74.5,-14.5; B29 75.5,-14.5; B30 76.5,-14.5; B31 77.5,-14.5; B32 78.6,-14.5
GPS = smd 2 x 1: 1PPS 8,-3.75; 3D-FIX -8,0.75; DMINUS -8,-2.25; DPLUSE -8,-0.75; EX_ANT 8,-6.75; GND1 -8,3.75; GND2 -8,-3.75; GND3 8,-5.25; GND4 8,5.25; NC1 8,-0.75; NC2 8,0.75; NC3 8,2.25; NC4 8,3.75; NRESET -8,5.25; RTCM 8,-2.25; RXDA -8,-6.75; TXDA -8,-5.25; USB-VCC 8,6.75; VBACKUP -8,2.25; VCC -8,6.75
OSCILLATOR = smd 2 x 1.8: E/D -2.1,2.59; GND -2.1,-2.59; NC1 -2.1,0; NC2 2.1,0; OUTPUT 2.1,-2.59; VDD 2.1,2.59
BU-SMA-V = drill 1.27: 1 0,0 | drill 1.778: 2 -2.55,2.55; 3 2.55,2.55; 4 2.55,-2.55; 5 -2.55,-2.55
32005-201 = smd 3.1 x 0.5: 1 3,1.6; 2 3,0.8; 3 3,0; 4 3,-0.8; 5 3,-1.6 | smd 2.5 x 2: M1 -3,-4.45; M2 -3,4.45 | smd 3.3 x 2: M3 2.9,4.45; M4 2.9,-4.45 | hole 0.9: 0,2.2; 0,-2.2

### Placement (x,y rotation side)
C1  29.21,61.72 0 top
C2  51.12,62.04 0 top
C3  70.17,62.04 0 top
C4  39.69,66.8 180 top
C5  60.64,67.12 0 top
C6  80.01,67.12 0 top
C7  40.64,70.45 90 top
C8  61.59,70.93 270 top
C9  80.17,72.04 90 top
C10  7.14,76.48 180 top
C11  80.8,31.72 180 top
C12  80.8,35.53 180 top
C13  85.88,24.41 0 top
C14  13.34,31.72 0 top
C15  19.05,59.97 0 top
C16  70.48,25.84 180 top
C17  18.41,37.43 180 top
C18  36.04,32.99 270 top
C19  49.37,50.29 0 top
C20  45.72,29.02 180 top
C21  46.51,52.2 315 top
C22  32.7,36.48 270 top
C23  54.93,32.99 0 top
C24  33.18,49.18 180 top
C25  26.35,52.83 0 top
C26  17.46,75.69 0 top
C27  20.32,66.8 270 top
IC1  6.35,23.62 0 top
IC2  78.74,24.26 180 top
IC3  64.77,12.98 180 top
JP1  29.21,17.27 180 top
JP2  28.57,23.62 0 top
JP3  94.61,29.65 90 top
JP4  15.56,20.76 90 top
LED1  23.18,73.15 0 top
Q1  87.63,33.62 270 top
QG1  9.84,54.73 0 top
QG2  9.84,40.45 0 top
R1  41.59,63.31 270 top
R2  40.01,58.54 0 top
R3  59.37,63.62 270 top
R4  63.82,63.62 270 top
R5  23.5,77.59 270 top
R6  38.1,63.31 270 top
R7  61.59,59.5 180 top
R8  80.17,62.99 180 top
R9  20.95,30.6 270 top
R10  24.92,30.6 270 top
R11  30.48,28.06 0 top
R12  54.93,35.37 180 top
R13  7.62,16 180 top
R14  7.94,30.92 180 top
R15  3.49,30.29 90 top
R16  71.12,15.05 180 top
R17  76.52,16.95 0 top
R18  54.93,25.21 180 top
R19  56.83,30.92 0 top
R20  72.71,55.37 0 top
S1  41.59,22.67 0 top
SV1  7.3,68.7 90 top
TP1  3.02,12.19 0 top
TP2  10.79,16 0 top
TP3  20.64,35.37 0 top
TP4  27.78,50.13 0 top
TP5  50.8,28.38 0 top
TP6  59.69,37.27 0 top
TP7  64.61,36 0 top
TP8  29.05,56.48 0 top
TP9  24.77,48.23 0 top
TP10  70.8,46.32 0 top
TP11  70.17,41.08 0 top
TP12  66.36,43.46 0 top
TP13  48.9,18.06 0 top
TP14  50.64,31.4 0 top
TP15  55.09,20.92 0 top
TP16  41.59,27.75 0 top
TP17  58.42,23.62 0 top
TP18  66.2,29.65 0 top
U2  41.91,42.35 225 top
U$1  31.43,73.15 0 top
U$2  51.75,73.15 0 top
U$3  71.12,73.15 0 top
U$4  0,16 0 top
U$5  50.16,52.04 0 top
U$6  85.72,51.24 0 top
U$7  19.53,55.37 180 top
U$8  20.16,42.99 0 top
X1  94.46,65.37 0 top
X2  89.06,74.58 270 top

### Tracks (layer width: path | path; a pad name or v marks a point on that pad's centre or on a via)
+5V  (via drill 0.6)
  Top 0.254: TP1.TP 3.49,11.24 5.87,13.62 | 52.5,10.81 52.18,11.03 52.39,10.92 | 49.85,13.46 53.34,13.46 54.61,12.19 v54.61,11.55 | v66.36,11.71 66.67,11.4 IC3.8
  Top 0.406: C10.1 8.26,76.64 | LED1.A 25.08,72.1 25.08,72.2
  Top 0.61: 25.08,79.5 25.72,80.14 44.13,80.14 44.29,79.98 44.45,80.14 64.45,80.14 65.09,79.5 65.09,67.75 68.9,67.75 69.22,67.44 69.22,62.04 | U$4.B08(+5V) v52.5,7.75 52.5,10.81 52.39,10.92 49.85,13.46 49.53,13.78 7.62,13.78 7.3,13.46 6.03,13.46 5.87,13.62 1.27,18.22 1.27,75.69 4.45,78.87 6.03,78.87 8.26,76.64
  Top 0.813: 10.16,74.34 10.16,71.25 11.45,69.95 SV1.1 13.55,69.97 20.32,69.97 C27.+ 25.08,69.34 | 10.16,74.34 C10.1 | 25.08,79.5 25.08,72.2 25.08,69.34 | 25.08,69.34 25.08,68.23 U$1.1 | U$1.1 28.03,62.05 C1.1 | U$1.1 U$1.2 | 44.29,79.98 45.4,78.87 45.4,67.44 47.56,65.28 U$2.1 U$2.2 50.27,65.06 C2.1 | 69.37,62.04 C3.1 | C3.1 69.22,62.04 | U$3.2 69.42,62.14 C3.1 | 10.16,74.34 13.58,74.34 C26.+
  Bottom 0.254: v54.61,11.55 54.93,11.55 55.24,11.24 65.88,11.24 v66.36,11.71
  Bottom 0.61: U$4.B08(+5V) v52.5,7.75
BUS0+  (via drill 0.6)
  Top 0.254: IC3.6 64.14,7.11 v64.45,7.11
  Bottom 0.254: v64.45,7.11 64.45,1.55 U$4.A18(BUS0+)
BUS0-  (via drill 0.6)
  Top 0.254: 63.5,11.24 63.82,11.55 65.09,11.55 65.41,11.24 IC3.7 65.41,6.16 v63.5,6.16
  Bottom 0.254: v63.5,6.16 U$4.A17(BUS0-)
CS  (via drill 0.6)  (1 unrouted)
  Top 0.254: IC2.32 81.54,16.9 79.85,15.21 73.82,15.21 v71.91,13.3
  Bottom 0.254: v71.91,13.3 69.37,10.76 49.53,10.76 47.47,8.7 47.47,1.55 47.62,1.39
CS_EEPROM  (via drill 0.6)
  Top 0.254: IC1.4 8.24,20.75 8.41,20.92 | 6.67,24.73 6.67,22.51 10.32,22.51 10.64,22.19 10.64,21.56 10,20.92 8.41,20.92 | 6.67,24.73 6.03,24.73 5.08,25.68 5.08,27.75 R15.1 | U2.P27 39.05,52.99 33.5,52.99 v33.02,52.51 | v8.89,24.73 6.67,24.73 | JP4.3 16.51,18.22 15.4,19.33 10,19.33 8.41,20.92
  Bottom 0.254: v33.02,52.51 31.59,51.08 26.51,46.16 26.51,41.88 9.37,24.73 v8.89,24.73
D+  (via drill 0.6)
  Top 0.406: X2.3 89.06,69.82 86.36,67.12 86.36,64.74 v83.66,62.04 | v72.87,51.72 74.09,50.49 U$6.DPLUSE
  Bottom 0.406: v83.66,62.04 80.33,62.04 72.87,54.58 v72.87,51.72
D-  (via drill 0.6)
  Top 0.406: X2.2 89.86,69.51 87.31,66.96 87.31,63.94 84.45,61.09 76.36,61.09 v75.41,60.13 | v73.82,49.18 77.54,49.18 U$6.DMINUS
  Bottom 0.406: v75.41,60.13 75.41,58.54 71.91,55.05 71.91,51.08 v73.82,49.18
DI
  Top 0.254: IC2.31 80.73,21.87 76.36,21.87 74.3,19.81 64.61,19.81 63.02,18.22 63.02,16.38 IC3.4
FASTCLK+  (via drill 0.6)  (2 unrouted)
  Top 0.254: v66.04,23.14 64.93,23.14 63.98,24.1 63.98,26 62.07,27.91 62.07,39.34 | 62.07,39.34 53.82,47.59 50.01,47.59 49.05,46.64 | TP6.TP 60.01,37.27 62.07,39.34
  Bottom 0.254: v66.04,23.14 66.04,20.13 71.44,14.57 73.82,14.57 75.09,13.3 75.09,8.54 75.41,8.22 75.41,7.43 | 75.41,7.43 75.41,1.55 75.56,1.39 | U$4.A31(FASTCLK3V3) 77.5,7.4 77.47,7.43 75.41,7.43
FASTCLK-  (via drill 0.6)
  Top 0.254: v65.25,23.94 65.25,25.68 62.55,28.38 62.55,37.11 | U2.P10 48.8,47.18 49.69,48.07 53.98,48.07 62.55,39.49 62.55,37.11 | TP7.TP 63.66,36 62.55,37.11
  Bottom 0.254: v65.25,23.94 65.25,19.97 71.12,14.1 73.18,14.1 74.3,12.98 74.3,5.84 74.5,5.63
  Bottom 0.406: U$4.A28(FASTCLK-) 74.5,5.63
FPGA_SPI_CLOCK  (via drill 0.6)
  Top 0.254: v44.61,38.23 44.61,36.12 U2.P83 | QG2.5 25.4,44.26 | 25.4,44.26 26.51,44.26 | 26.51,44.26 28.73,46.48 v28.89,46.48 | TP9.TP 24.77,44.89 25.4,44.26 | U$8.OUTPUT 23.92,40.4 25.88,42.35 25.88,43.62 26.51,44.26
  Top 0.406: C17.1 19.15,37.45 19.7,37.45 22.23,39.97 U$8.OUTPUT
  Bottom 0.254: v44.61,38.23 36.2,46.64 v28.89,46.48
GND  (via drill 0.6)  (3 unrouted)
  Top 0.254: JP1.2 33.02,22.35 JP2.9 | IC2.3 83.1,22.98 86.68,22.98 86.73,22.93 87.15,22.51 94.14,22.51 94.61,22.98 94.61,25.05 93.34,26.32 JP3.4 JP3.6 JP3.8 JP3.10 | C12.2 C11.2 | C24.2 32.33,49.1 U2.P42 34.77,46.64 35.56,45.84 35.56,44.42 34.52,43.38 | U2.P63 34.77,35.21 | 34.77,35.21 34.77,34.1 34.13,33.46 34.13,31.88 34.45,31.56 35.62,31.56 C18.2 | U2.P74 39.21,31.88 36.51,31.88 | 36.51,31.88 36.2,31.88 36.04,32.03 36.04,32.19 | U2.P74 | U2.P74 41.75,34.41 44.19,34.41 U2.P80 45.91,32.7 | 45.91,32.7 46.2,32.41 46.2,30.29 44.93,29.02 C20.2 44.87,24.95 S1.2 | C19.2 50.01,50.29 50.16,50.45 | 34.52,43.38 36.2,41.7 36.2,40.13 34.45,38.38 | 34.52,43.38 U2.P47 | U2.P95 50.08,39.1 47.94,41.24 | 47.94,41.24 47.62,41.24 46.51,40.13 46.51,39.02 46.83,38.7 | 47.62,38.7 47.68,38.7 U2.P91 48.64,37.69 47.62,38.7 | 47.62,38.7 46.83,38.7 | 46.83,38.7 46.2,38.07 46.2,37.36 U2.P87 47.52,36.11 v48.42,35.21 | v45.56,32.35 45.91,32.7 | v56.99,32.83 55.94,32.83 C23.2 55.78,31.03 R19.1 55.78,30.92 R18.1 | 47.94,41.24 47.94,44.73 | 47.94,44.73 48.74,45.64 U2.P8 | 47.36,48.43 45.72,46.96 47.94,44.73 | IC3.5 62.87,7.9 v62.39,7.9 | IC2.21 70.73,23.85 69.53,25.05 69.53,25.74 C16.2 | U2.P58 34.41,38.35 33.66,37.59 33.66,36.58 33.45,36.37 | 33.45,36.37 C22.2 | 34.77,35.21 34.61,35.21 33.45,36.37 | U2.P69 38.3,34.46 37.31,33.46 37.31,32.67 36.51,31.88 | 87,68.7 87.46,69.17 X2.5 | 87,68.7 82.71,68.7 82.55,68.81 | 87,68.7 86.2,67.91 85.72,67.91 v85.41,67.59 | JP4.6 JP4.8 | QG2.4 13.65,38.53 14.76,39.65 15.51,40.4 U$8.GND | 53.5,6.47 U$4.B09(GND) 53.5,9.33 | 53.5,9.33 53.5,10.28 | 53.5,10.28 53.5,10.29 | 53.5,10.28 53.5,11.71 v53.18,12.03
  Top 0.254: v54.29,9.33 53.5,9.33
  Top 0.305: C21.2 47.12,51.09 | 47.12,51.09 U2.P18 | U2.P14 47.36,48.43 48.26,49.34 49.85,49.34 50.16,49.66 50.16,50.45 50.16,51.08 49.85,51.4 48.74,51.4 47.44,51.4 47.12,51.09
  Top 0.406: IC1.7 5.71,25.84 6.03,25.52 9.53,25.52 14.19,30.19 C14.2 | QG1.4 11.75,49.02 11.75,38.54 QG2.4 13.65,36.16 14.13,35.68 14.13,31.72 | C5.2 61.49,66.9 61.59,66.8 | 61.59,66.8 R4.1 | 61.59,66.8 C8.2 61.51,69.98 58.42,69.98 56.52,68.07 52.7,68.07 | U$2.3 51.75,65.21 | U$2.3 51.75,62.25 C2.2 52.07,61.93 | U$2.3 51.75,67.44 52.39,68.07 52.7,68.07 | U$2.6 51.75,69.02 52.7,68.07 | R7.1 62.55,59.5 62.55,57.91 | 62.55,57.91 62.39,57.75 | 54.29,57.59 54.13,57.75 | 71.12,62.14 C3.2 | 71.12,65.21 71.12,64.9 | 71.12,64.9 71.12,62.14 | 71.12,62.14 v71.12,60.45 | v63.18,57.27 62.55,57.91 | 71.12,65.21 70.8,65.53 70.8,65.21 71.12,64.9 | R8.1 80.96,63.15 80.96,66.86 C6.2 82.55,68.81 82.55,71.56 81.2,72.91 80.17,72.91 80.17,72.83 | 74.68,72.75 U$3.6 U$3.3 71.12,65.21 | C13.2 86.73,22.93 | C15.2 26.83,59.97 26.91,60.05 | IC2.21 81.04,23.85 | 81.04,23.85 81.76,24.57 82.95,24.57 IC2.5 | IC2.3 81.84,23.05 81.04,23.85 | v76.5,6.49 75.72,7.27 v73.5,7.27 | C11.2 80.01,31.72 80.01,36.95 84.61,41.56 90.33,41.56 91.28,40.61 91.28,36.8 JP3.10 | R20.1 70.33,55.37 v70.33,56.32 | SV1.2 6.29,67.45 C10.2 | C9.2 74.77,72.89 74.77,72.83 | 74.77,72.83 74.61,72.83 74.61,72.67 74.77,72.67 74.77,72.83
  Top 0.61: 40.64,71.25 40.72,71.32 42.47,71.32 43.81,69.98 43.81,67.75 46.99,64.58 46.99,62.04 48.58,60.45 51.44,60.45 | 51.44,60.45 52.07,61.09 52.07,61.93 | 62.39,57.75 61.75,58.23 58.74,58.23 58.1,57.59 54.29,57.59 | 51.44,60.45 54.13,57.75 48.74,52.35 48.74,51.4 | U$4.B07(GND) 51.5,8.95 v48.74,11.55 | U$4.B09(GND) 53.5,6.47 53.5,10.29 53.5,11.55 53.18,11.87 v53.18,12.03 53.5,11.71 | U$4.B11(GND) 55.5,7.11 | 55.5,7.11 55.5,9.71 | v54.77,7.75 54.87,7.75 55.5,7.11
  Top 0.813: SV1.2 16.21,67.45 | C1.2 31.11,61.72 | 31.11,61.72 31.43,62.04 U$1.3 | 26.35,64.58 26.35,60.93 26.99,60.13 | 26.99,60.13 31.43,60.13 31.75,60.45 | 31.75,60.45 31.75,61.09 31.11,61.72 | U$1.3 U$1.6 | U$1.3 31.43,67.75 32.07,68.39 36.83,68.39 | 36.83,68.39 37.25,68.39 C4.2 38.84,65 R6.1 | C7.2 40.64,71.25 40.56,71.32 38.81,71.32 38.42,70.93 38.42,69.98 36.83,68.39 | R2.1 33.66,58.54 31.75,60.45 | QG1.4 23.65,50.92 23.65,56.8 26.91,60.05 26.99,60.13
  Bottom 0.254: S1.2 S1.1 35.76,22.35 JP2.9 JP2.7 JP2.5 JP2.3 24.13,22.35 JP2.1 | 47.47,34.26 v45.56,32.35 | v48.42,35.21 47.47,34.26 | 47.47,34.26 47.47,33.14 47.94,32.67 56.83,32.67 v56.99,32.83 | v62.39,7.9 65.88,7.9 | v73.5,7.27 72.87,7.27 72.39,7.75 67.31,7.75 | 65.88,7.9 66.04,7.75 67.31,7.75 | v85.41,67.59 91.58,67.59 X1.2 X1.3 X1.4 | JP4.4 JP4.6 | JP4.8 JP4.10 | U$4.A22(GND) 68.5,6.55 67.31,7.75 | U$4.A19(GND) 65.5,6.73 65.88,7.11 65.88,7.9 | U$4.B09(GND) 53.5,8.54 v54.29,9.33
  Bottom 0.406: v71.12,60.45 66.36,60.45 v63.18,57.27 | v62.39,7.9 60.64,9.65 55.98,9.65 55.5,9.17 54.93,8.54 54.93,7.9 v54.77,7.75 | v70.33,56.32 70.33,56.16 | v76.5,6.49 76.5,1.41 76.52,1.39 | U$4.A27(GND) v73.5,7.27
  Bottom 0.61: v48.74,11.55 49.21,12.03 v53.18,12.03 47.78,12.03 47.47,11.71 | 45.72,11.71 44.61,12.82 20.48,12.82 18.89,14.41 18.89,19.49 21.75,22.35 24.13,22.35 | U$4.B07(GND) 51.5,8.92 51.75,9.17 53.5,9.17 53.5,9.02 | 53.5,9.02 53.5,8.86 | 53.5,8.86 53.5,1.39 | 53.5,9.02 v54.77,7.75 55.5,7.01 U$4.B11(GND) | U$4.B09(GND) 53.5,8.86
  other vias: 21.91,10.13 81.92,15.05 74.3,17.43 43.34,44.73 39.85,48.38 58.58,20.29 55.72,28.06 60.33,28.22 55.88,51.72
  pour Top (isolate 0.406): 0,80.61 99.85,80.61 100.01,3.78 83.19,3.78 83.19,10.76 81.76,12.19 80.33,12.19 78.9,10.76 78.9,9.81 45.24,9.81 45.09,9.97 45.09,10.76 43.81,12.03 42.07,12.03 40.64,10.6 40.64,3.93 0,3.93
  pour Bottom (isolate 0.406): 0,3.93 40.96,3.93 40.96,10.92 41.91,11.87 44.13,11.87 45.09,10.92 45.09,9.81 78.9,9.81 78.9,10.6 80.33,12.03 81.76,12.03 83.03,10.76 83.03,3.78 100.01,3.78 100.01,80.77 0,80.77
GPS_NRESET  (via drill 0.6)  (1 unrouted)
  Top 0.254: R20.2 74.61,55.37 v75.09,54.89 | v80.8,30.13 81.6,29.34 81.6,28.54 | TP12.TP 68.74,43.46 v69.06,43.78
  Top 0.406: U$6.NRESET 74.78,56.49 R20.2
  Bottom 0.254: v75.09,54.89 75.09,46.32 74.77,46 74.77,45.37 | 74.77,45.37 75.09,45.05 75.09,34.1 78.9,30.29 80.64,30.29 v80.8,30.13 | v69.06,43.78 72.39,43.78 73.82,45.21 74.61,45.21 74.77,45.37
GPS_RX  (via drill 0.6)
  Top 0.254: U$6.RXDA 75.64,44.49 v74.3,43.3 | v77.95,29.97 79.22,29.97 79.85,29.34 79.85,28.64 IC2.11 | TP11.TP 72.07,41.08 v74.3,43.3 | v74.3,43.3 74.3,43.15
  Bottom 0.254: v74.3,43.3 74.3,42.83 74.45,42.67 74.45,33.94 77.63,30.76 77.63,30.29 v77.95,29.97
GPS_TX  (via drill 0.6)
  Top 0.254: v77.79,32.51 78.42,31.88 78.42,31.4 80.64,29.18 80.64,28.64 IC2.10 | TP10.TP 75.25,46.32 75.88,45.69 v75.72,45.69
  Top 0.406: U$6.TXDA 76.03,45.99 v75.72,45.69
  Bottom 0.254: v75.72,45.69 75.72,35.84 77.79,33.78 v77.79,32.51
IRQ  (via drill 0.6)
  Top 0.254: v76.83,26.8 78.9,26.8 79.06,26.95 79.06,28.46 IC2.12
  Bottom 0.254: v76.83,26.8 76.36,26.32 72.71,26.32 72.23,25.84 66.99,25.84 66.36,26.32 64.77,26.32 60.33,21.87 60.33,14.41 57.78,11.87 55.4,11.87 54.45,12.82 46.67,12.82 46.5,12.65 46.51,9.65 46.83,9.33 46.83,6.79 46.51,6.47 46.51,1.5 U$4.A02(IRQ)
MISO_EEPROM  (via drill 0.6)
  Top 0.254: U2.P51 31.85,40.87 v30.8,39.81 | v4.6,24.89 4.6,26.87 IC1.8 | JP4.9 16.83,25.37 16.03,24.57 12.54,24.57 11.75,23.78 7.94,23.78 v7.46,23.3
  Bottom 0.254: v30.8,39.81 25.08,39.81 9.05,23.78 7.46,23.78 | 7.46,23.78 5.71,23.78 v4.6,24.89 | v7.46,23.3 7.46,23.78
MOSI_EEPROM  (via drill 0.6)
  Top 0.254: U2.P46 33.3,45.25 31.43,47.11 30.48,47.11 29.69,46.32 29.69,40.77 v26.04,37.11 | v6.67,18.38 5.24,18.38 4.45,19.17 IC1.1
  Bottom 0.254: v26.04,37.11 23.65,37.11 8.89,22.35 8.89,19.17 | JP4.1 16.83,15.84 15.88,16.79 12.54,16.79 10.16,19.17 8.89,19.17 | 8.89,19.17 8.57,18.86 7.14,18.86 v6.67,18.38
N$1
  Top 0.254: R11.1 29.53,28.06 29.53,29.34 29.84,29.65 40.66,29.65 U2.P76
N$2  (via drill 0.6)
  Top 0.254: R10.1 24.92,31.56 31.59,31.55 v31.75,31.72 | v54.77,43.62 54.77,43.94 53.66,45.21 52.55,45.21 U2.P2
  Bottom 0.254: v31.75,31.72 42.86,31.72 v54.77,43.62
N$3
  Top 0.406: LED1.C 23.5,74.2 R5.2
N$4  (via drill 0.6)
  Top 0.254: R9.1 20.95,31.56 22.22,31.55 24.45,33.78 26.19,33.78 v26.99,32.99 | v53.18,43.62 53.18,44.1 52.86,44.42 52.46,44.42 U2.P1
  Bottom 0.254: v26.99,32.99 32.38,32.99 33.18,32.19 42.55,32.19 53.18,42.83 v53.18,43.62
N$5  (via drill 0.6)
  Top 0.254: IC3.3 IC3.2 65.41,17.91 66.67,19.17 69.53,19.17 70.17,18.54 v71.6,18.54 | IC2.2 83.03,22.19 81.92,22.19 81.6,21.87 81.6,21.4 83.03,19.97 v83.03,19.65
  Bottom 0.254: v71.6,18.54 81.92,18.54 v83.03,19.65
N$6
  Top 0.254: R16.1 72.71,15.05 73.34,15.68 77.37,15.68 R17.2 77.37,17.05 78.11,16.32 79.69,16.32 80.33,16.95 80.33,18.54 80.01,18.86 80.01,19.89 IC2.30
N$7  (via drill 0.6)
  Top 0.813: U$1.5 35.3,65.28 v36.2,66.17 | v43.5,64.26 41.59,64.26 R1.1 | R2.2 42.23,58.54 v43.81,60.13
  Bottom 0.813: v36.2,66.17 41.59,66.17 v43.5,64.26 43.81,63.94 v43.81,60.13
N$8
  Top 0.406: U$2.5 58.67,65.28 R3.1 59.38,64.58 60.64,64.58 62.55,62.67 R4.2
N$9
  Top 0.254: IC3.1 69.26,16.06 R16.2 70.17,15.05
N$11  (via drill 0.6)
  Top 0.254: Q1.2 87.63,28.86 86.28,27.51 | 86.28,27.51 85.09,26.32 83.1,26.32 IC2.7 | C11.1 81.65,30.71 v82.07,30.29 | v83.98,28.54 85.25,28.54 86.28,27.51
  Bottom 0.254: v82.07,30.29 82.23,30.29 v83.98,28.54
N$12
  Top 0.254: IC2.8 83.03,34.01 84.34,35.32 | 84.34,35.32 Q1.1 | C12.1 84.14,35.53 84.34,35.32
N$13  (via drill 0.6)
  Top 0.406: v49.85,9.02 46.99,9.02 v45.88,7.9 | v73.18,8.54 76.68,8.54 v76.83,8.7
  Bottom 0.406: v73.18,8.54 66.67,8.54 64.93,10.29 51.12,10.29 v49.85,9.02 | v45.88,7.9 45.88,6 45.4,5.52 45.4,1.6 U$4.A01(PRSNT1) | v76.83,8.7 77.15,8.7 78.6,7.25 U$4.A32(PRSNT2)
N$14  (via drill 0.6)
  Top 0.406: U$6.EX_ANT 95.64,44.49 v95.73,44.57
  Bottom 0.406: v95.73,44.57 95.73,59.81 94.46,61.09 X1.1
PPS  (via drill 0.6)
  Top 0.254: 72.5,10.97 69.53,13.94 61.44,13.94 58.42,16.95 56.2,16.95 48.74,24.41 48.74,27.27 | 48.74,27.27 48.74,32.99 50.01,34.26 50.01,34.96 U2.P89 | U$6.1PPS 96.78,47.49 97.95,46.32 97.95,31.56 98.27,31.24 98.27,14.41 97.16,13.3 84.45,13.3 | 84.45,13.3 74.83,13.3 72.5,10.97 | IC2.1 83.76,21.45 84.45,20.76 84.45,13.3 | TP5.TP 49.85,28.38 48.74,27.27 | v72.71,6.16 72.71,6.79 72.39,7.11 72.39,10.92 72.45,10.92 72.5,10.97
  Bottom 0.254: U$4.A26(PPS) 72.5,6.05 v72.71,6.16
PROG_B  (via drill 0.6)
  Top 0.254: S1.3 S1.4 44.84,21 46.83,22.98 46.83,25.84 v46.51,26.16 | R12.1 55.88,35.37 55.88,36.87 52.82,39.93 | 52.82,39.93 U2.P100 | v53.66,40.45 53.34,40.45 52.82,39.93 | JP4.5 20.32,20.76 v21.27,19.81
  Bottom 0.254: v46.51,26.16 46.04,26.16 43.18,29.02 43.18,31.4 51.75,39.97 53.18,39.97 v53.66,40.45 | v21.27,19.81 37.74,19.81 S1.3
RESET_EEPROM
  Top 0.406: R13.1 8.57,16 8.57,17.59 7.62,18.54 7.62,18.86 6.99,19.49 6.99,20.21 IC1.3
SCK_EEPROM  (via drill 0.6)
  Top 0.254: U2.P53 32.65,40.07 v30.48,37.91 | IC1.2 5.71,21.4 6.03,21.71 v7.94,21.71 v9.68,21.71
  Bottom 0.254: v30.48,37.91 23.81,37.91 7.94,22.03 v7.94,21.71 | JP4.7 16.67,23.3 15.4,22.03 10.32,22.03 10,21.71 v9.68,21.71
SLOWCLK/CLK  (via drill 0.6)
  Top 0.254: 52.39,19.33 55.72,16 57.94,16 60.96,12.98 68.9,12.98 70.48,11.4 v70.48,6.79 | 52.39,19.33 47.47,24.26 47.47,34.67 U2.P85 | TP13.TP 51.12,18.06 52.39,19.33
  Bottom 0.254: U$4.A24(SLOWCLKCLK) 70.5,6.14 v70.48,6.79
SLOWCLK/CS  (via drill 0.6)
  Top 0.254: v48.58,34.1 48.26,33.78 48.26,24.26 56.04,16.48 58.1,16.48 61.12,13.46 69.22,13.46 71.44,11.24 v71.44,6.16 | v52.7,39.02 52.31,39.02 U2.P98 | TP14.TP 50.64,33.14 v50.96,33.46
  Bottom 0.254: v48.58,34.1 49.21,34.1 | 49.21,34.1 49.21,35.21 49.85,35.84 v52.7,39.02 | v50.96,33.46 49.85,33.46 49.21,34.1 | U$4.A25(SLOWCLK/CS) 71.5,6.09 v71.44,6.16
SLOWCLK/MOSI  (via drill 0.6)
  Top 0.254: U2.P99 50.32,41.72 50.32,42.03 50.64,42.35 53.18,42.35 54.61,40.92 54.61,39.18 57.31,36.48 57.31,34.73 59.21,32.83 59.21,30.45 v59.69,29.97 | v57.78,15.05 60.33,12.51 68.58,12.51 69.5,11.59 69.5,6.51 v69.53,6.16 | TP15.TP 56.67,19.49 v56.52,19.33
  Bottom 0.254: v57.78,15.05 57.78,16.32 55.48,18.62 | 55.48,18.62 50.01,24.1 50.01,26.48 53.5,29.97 v59.69,29.97 | v56.52,19.33 56.2,19.33 55.48,18.62 | v69.53,6.16 69.53,1.53 U$4.A23(SLOWTIMEMOSI)
TCK  (1 unrouted)
  Top 0.254: 31.75,28.06 R11.2 31.11,28.06 JP2.8 31.11,24.26 29.84,22.98 29.84,17.91 JP1.3 30.48,16 31.43,15.05 56.36,15.05 61.59,9.81 61.59,1.71 61.44,1.55
TDI  (via drill 0.6)
  Top 0.254: JP1.5 25.4,19.81 24.77,20.45 24.77,23.62 JP2.4 24.92,26 R10.2 | v55.88,13.46 55.88,12.51 58.42,9.97 58.58,9.81 58.74,9.65 v58.74,8.38
  Bottom 0.254: JP1.5 25.4,16.63 27.62,14.41 54.93,14.41 v55.88,13.46 | U$4.A12(TDI) 58.5,8.14 v58.74,8.38
TDO  (via drill 0.6)
  Top 0.254: JP1.4 27.94,21.08 27.3,21.71 27.3,23.62 JP2.6 27.78,25.68 27.78,29.65 28.89,30.76 38.73,30.76 40.35,32.38 U2.P75 | v56.83,12.67 56.99,12.67 59.69,9.97 v59.69,7.43
  Bottom 0.254: JP1.4 27.94,15.52 28.57,14.89 56.36,14.89 56.83,14.41 v56.83,12.67 | U$4.A13(TDO) 59.5,7.24 v59.69,7.43
TIMING_CLK  (via drill 0.6)
  Top 0.254: U2.P84 46.19,35.21 45.09,36.32 45.09,37.43 45.72,38.07 45.72,43.94 45.88,44.1 v45.88,44.57 | TP8.TP 26.35,56.48 v25.72,55.85 | QG1.5 16.36,58.54 U$7.OUTPUT
  Top 0.406: C25.1 25.72,53.15 v25.72,55.85
  Bottom 0.254: v45.88,44.57 36.35,54.1 26.19,54.1 | 26.19,54.1 18.1,54.1 QG1.5 | v25.72,55.85 25.72,54.58 26.19,54.1
TIMING_RESET
  Top 0.254: U2.P93 49.41,38.35 51.75,36 52.39,36 53.02,36.64 54.61,36.64 54.93,36.32 54.93,34.26 57.15,34.26 57.78,33.62 57.78,31.24 57.78,30.92 | IC2.24 67.25,21.45 64.55,21.45 58.26,27.75 57.78,28.23 57.78,30.92 | 57.78,30.92 R19.2 57.78,30.92
TMS  (via drill 0.6)
  Top 0.254: R9.2 20.95,27.43 JP2.2 22.23,23.62 22.23,19.17 22.86,18.54 JP1.6 25.72,14.41 56.2,14.41 60.33,10.29 60.5,10.11 60.64,9.97 v60.64,6.47
  Bottom 0.254: U$4.A14(TMS) 60.5,6.33 v60.64,6.47
UC_FPGA_SPI_CS  (via drill 0.6)
  Top 0.254: U2.P90 52.55,33.13 52.55,29.49 53.98,28.06 53.98,25.31 R18.2 52.07,25.21 v51.75,24.89 53.02,23.62 TP17.TP | IC2.23 71.53,22.26 69.69,24.1 69.53,24.1 67.94,25.68 v67.94,26.64
  Bottom 0.254: v67.94,26.64 66.99,26.64 66.83,26.8 63.66,26.8 63.18,26.32 53.18,26.32 v51.75,24.89
UC_MISO
  Top 0.254: IC2.16 75.94,29.12 74.45,30.6 74.45,32.19 84.3,42.19 90.65,42.19 95.89,36.95 JP3.9
UC_MOSI  (via drill 0.6)
  Top 0.254: U2.P97 50.82,39.79 v52.86,37.75 | v76.68,30.29 76.68,28.61 IC2.15 | TP18.TP 66.2,32.51 v66.83,33.14
  Bottom 0.254: 66.99,31.88 62.55,31.88 57.15,37.11 53.5,37.11 v52.86,37.75 | 66.99,31.88 75.72,31.88 76.68,30.92 v76.68,30.29 76.68,29.81 76.83,29.65 78.42,28.22 78.42,25.21 79.06,24.57 91.44,24.57 92.71,23.3 94.46,23.3 95.73,24.57 JP3.1 | v66.83,33.14 66.83,32.03 66.99,31.88
UC_RESET  (via drill 0.6)
  Top 0.254: JP3.5 96.84,29.65 97.79,28.7 97.79,18.86 v96.84,17.91 | v79.06,17.43 79.06,19.88 IC2.29
  Bottom 0.254: v96.84,17.91 79.53,17.91 v79.06,17.43
UC_SCK  (via drill 0.6)
  Top 0.254: U2.P77 v45.4,31.08 43.97,31.08 42.07,29.18 42.07,27.75 TP16.TP | v72.71,27.11 74.39,27.11 IC2.17 74.45,29.98 73.98,30.45 73.98,32.51 84.14,42.67 90.81,42.67 97.47,36 97.47,33.78 JP3.7
  Bottom 0.254: v45.4,31.08 68.74,31.08 v72.71,27.11
USBVCC
  Top 0.406: X2.1 90.66,69.19 89.69,68.23 89.69,61.4 91.12,59.97 94.14,59.97 94.61,59.5 94.61,58.7 93.82,57.91 | 93.82,57.91 93.82,58.07 | 93.82,58.07 93.98,57.91 93.82,57.91 | 93.82,58.07 93.8,58.07 U$6.USB-VCC
VCC1.2  (via drill 0.6)
  Top 0.254: C20.1 46.67,29.02 46.67,32.58 46.57,32.74 U2.P81 45.16,34.18 43.66,35.68 | 43.66,35.68 39.53,35.68 38.89,36.32 38,36.32 U2.P66 36.04,34.36 C18.1 | 46.22,49.52 U2.P17 46.19,49.49 | 48.1,50.45 48.2,50.45 C19.1 48.26,50.29 48.1,50.45 | 46.19,49.49 43.97,47.27 | 43.97,47.27 43.66,46.96 37.31,46.96 36.67,47.59 | 36.67,47.59 | 36.67,47.59 U2.P38 35.08,49.18 C24.1 33.08,50.13 TP4.TP | 43.66,35.68 43.66,38.54 45.09,39.97 45.09,46.16 43.97,47.27 | 48.1,50.45 47.15,50.45 46.22,49.52 | 46.22,49.52 46.19,49.49 | 43.97,47.27 41.12,50.13 41.12,50.77 v44.45,54.26
  Top 0.406: C6.1 78.84,67.44 76.83,67.44 74.67,65.28 U$3.5 U$3.4 72.82,59.61 v72.07,58.86 | R8.2 79.38,62.99 79.38,66.9 C6.1 | C6.1 79.16,70.32 80.17,71.25 C9.1
  Bottom 0.254: v72.07,58.86 66.83,58.86 62.71,54.73 44.77,54.73 v44.45,54.26
VCC2.5  (via drill 0.6)
  Top 0.254: R12.2 51.72,35.37 U2.P92 | v34.92,40.92 33.45,39.45 U2.P55 33.35,39.35 32.54,38.54 32.54,37.43 32.65,37.33 | U2.P92 47.6,39.49 v47.47,39.49 47.62,39.49 49.05,38.07 U2.P92 | 43.34,50.13 43.33,50.13 | 43.33,50.13 U2.P22 44.46,51.34 C21.1 45.91,52.7 | 43.33,50.13 v42.7,50.13 | v54.61,61.56 54.61,62.04 54.93,62.35 | 32.65,37.33 32.7,37.27 | 32.65,37.33 C22.1 30.74,35.37 TP3.TP
  Top 0.305: 46.04,52.93 C21.1 | C23.1 R12.2
  Top 0.406: C5.1 56.52,67.12 56.2,67.44 54.29,67.44 53.34,66.48 53.34,65.39 U$2.4 53.45,63.83 54.93,62.35 59.05,62.35 | 59.05,62.35 R3.2 | 59.05,62.35 59.05,61.09 R7.2 60.8,59.5 60.8,61.09 64.77,61.09 67.72,64.03 67.72,64.74 | U$3.1 67.72,64.74 | C8.1 61.59,71.88 63.82,71.88 63.98,71.8 63.98,66.96 65.5,66.96 67.72,64.74
  Bottom 0.254: v34.92,40.92 38.42,40.92 42.7,36.64 44.29,36.64 47.15,39.49 v47.47,39.49 47.47,45.69 v42.7,50.13 42.86,54.58 49.37,61.09 54.13,61.09 v54.61,61.56
VCC3.3  (via drill 0.6)  (1 unrouted)
  Top 0.254: JP1.1 35.56,22.98 JP2.10 | IC2.6 83.66,25.45 92.46,25.45 JP3.2 | v6.67,14.57 6.67,16 6.67,16.16 | 2.86,31.24 6.99,31.24 6.99,27.11 | U$6.VBACKUP 70.46,53.49 69.22,54.73 69.22,57.99 | 11.11,16.32 TP2.TP 9.53,14.73 6.83,14.73 v6.67,14.57 | JP4.2 14.29,15.52 13.18,14.41 6.83,14.41 v6.67,14.57 | 19.21,52.78 U$7.VDD 12.02,52.78 7.14,47.91 7.14,45.37 QG2.8 | 19.21,52.78 U$7.E/D | U$8.E/D U$8.VDD 15.45,45.58 15.4,45.53 14.61,45.53 v13.34,46.8 | C15.1 18.2,59.87 19.21,58.86 19.21,52.78
  Top 0.406: R14.2 6.99,30.92 IC1.6 | R14.2 6.67,31.24 3.65,31.24 3.65,31.14 R15.2 3.49,31.24 2.86,31.24 2.22,30.6 2.22,28.06 2.86,27.43 2.86,18.54 5.4,16 6.67,16 R13.2 | QG2.8 6.03,41.24 8.26,39.02 8.26,33.62 | 8.26,33.62 7.14,32.51 7.14,31.08 R14.2 | 33.13,63.2 33.13,62.15 v32.86,61.88 | C13.1 84.45,24.73 | 84.45,24.73 84.39,24.73 83.66,25.45 | IC2.4 84.06,23.85 84.3,24.1 84.3,24.57 84.45,24.73 | C14.1 10.16,31.72 8.26,33.62 | C15.1 7.46,59.97 QG1.8 | C16.1 72.87,25.84 73.18,26.16 74.35,26.16 IC2.18 75.79,26.26 76.52,25.52 83.03,25.52 | U$6.VCC 69.22,57.99 67.47,57.99 65.72,56.32 62.07,56.32 61.12,57.27 v60.17,57.27 | C4.1 40.54,65.75 39.85,65.05 39.85,62.52 39.69,62.36
  Top 0.61: C16.1 71.33,34.2 60.17,45.37 v60.17,57.27
  Top 0.813: C4.1 40.54,69.56 40.64,69.66 C7.1 | R1.2 39.69,62.36 R6.2 38.1,62.35 33.97,62.35 33.13,63.2 U$1.4
  Bottom 0.254: JP2.10 33.66,25.52 33.02,26.16 20.64,26.16 18.26,23.62 18.26,14.41 v6.67,14.57 | v13.34,46.8 8.73,46.8 6.03,44.1 QG2.8
  Bottom 0.406: QG2.8 5.87,44.26 4.29,45.84 4.29,58.54 QG1.8 9.37,61.88 v32.86,61.88
  Bottom 0.61: v60.17,57.27 60.17,58.86 54.77,64.26 50.8,64.26 44.61,58.07 36.67,58.07 v32.86,61.88
WP_EEPROM
  Top 0.406: IC1.5 8.26,30.29 R14.1
(copper drawn outside any net)
  shapes: Bottom area x2

### Text on the board
Top: hgg flutter0
Bottom: (CC-BY-NC-SA) 2012 | timm@hgg.aero
tPlace: 5V